# EAGLE design Euclid_Upper (EAGLE 8.2.1)
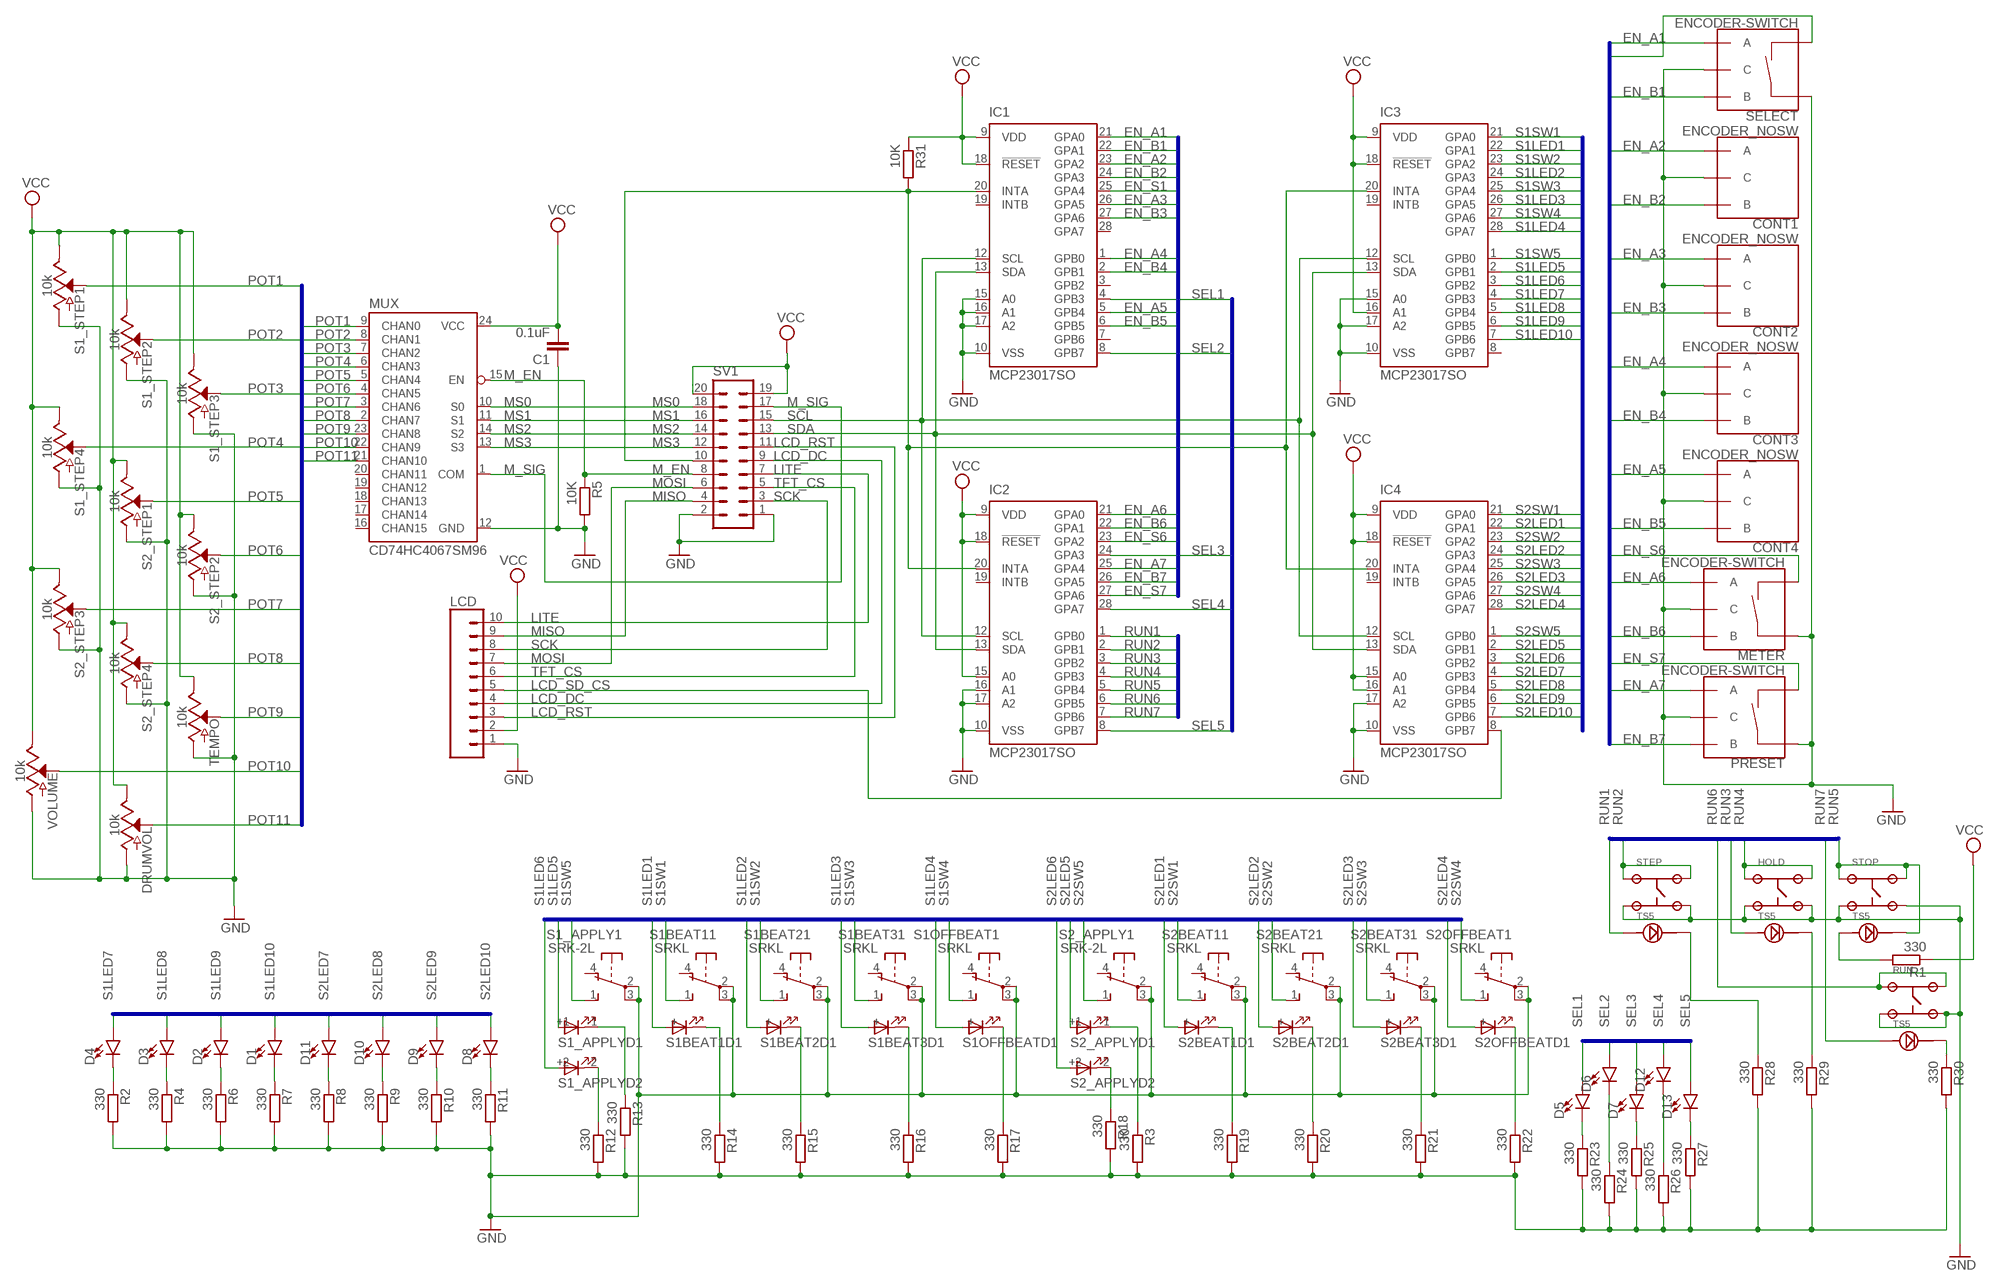
[diagram p0: schematic, sheet 1]

## Parts
C1  0.1uF  C-EUC0603  [C0603]
CONT1  ENCODER_NOSW  [ENCODER_NOSW]
CONT2  ENCODER_NOSW  [ENCODER_NOSW]
CONT3  ENCODER_NOSW  [ENCODER_NOSW]
CONT4  ENCODER_NOSW  [ENCODER_NOSW]
D1  LED3MM  [LED_3MM]
D2  LED3MM  [LED_3MM]
D3  LED3MM  [LED_3MM]
D4  LED3MM  [LED_3MM]
D5  LED3MM  [LED_3MM]
D6  LED3MM  [LED_3MM]
D7  LED3MM  [LED_3MM]
D8  LED3MM  [LED_3MM]
D9  LED3MM  [LED_3MM]
D10  LED3MM  [LED_3MM]
D11  LED3MM  [LED_3MM]
D12  LED3MM  [LED_3MM]
D13  LED3MM  [LED_3MM]
DRUMVOL  10k  POTENTIOMETER-PTH-9MM-1/20W-20%  [POT-PTH-ALPS]
HOLD  TS5  [TS5]
IC1  MCP23017SO  [SO28W]
IC2  MCP23017SO  [SO28W]
IC3  MCP23017SO  [SO28W]
IC4  MCP23017SO  [SO28W]
LCD  CONN_10"  [1X10]
METER  ENCODER-SWITCH  [ROTARY_ENC_PLAIN]
MUX  CD74HC4067SM96  74HC4067SM96  [SSOP24]
PRESET  ENCODER-SWITCH  [ROTARY_ENC_PLAIN]
R1  330  R-EU_R0603  [R0603]
R2  330  R-EU_R0603  [R0603]
R3  330  R-EU_R0603  [R0603]
R4  330  R-EU_R0603  [R0603]
R5  10K  R-EU_R0603  [R0603]
R6  330  R-EU_R0603  [R0603]
R7  330  R-EU_R0603  [R0603]
R8  330  R-EU_R0603  [R0603]
R9  330  R-EU_R0603  [R0603]
R10  330  R-EU_R0603  [R0603]
R11  330  R-EU_R0603  [R0603]
R12  330  R-EU_R0603  [R0603]
R13  330  R-EU_R0603  [R0603]
R14  330  R-EU_R0603  [R0603]
R15  330  R-EU_R0603  [R0603]
R16  330  R-EU_R0603  [R0603]
R17  330  R-EU_R0603  [R0603]
R18  330  R-EU_R0603  [R0603]
R19  330  R-EU_R0603  [R0603]
R20  330  R-EU_R0603  [R0603]
R21  330  R-EU_R0603  [R0603]
R22  330  R-EU_R0603  [R0603]
R23  330  R-EU_R0603  [R0603]
R24  330  R-EU_R0603  [R0603]
R25  330  R-EU_R0603  [R0603]
R26  330  R-EU_R0603  [R0603]
R27  330  R-EU_R0603  [R0603]
R28  330  R-EU_R0603  [R0603]
R29  330  R-EU_R0603  [R0603]
R30  330  R-EU_R0603  [R0603]
R31  10K  R-EU_R0603  [R0603]
RUN  TS5  [TS5]
S1_APPLY  SRK-2L  [SRK2L]
S1_STEP1  10k  POTENTIOMETER-PTH-9MM-1/20W-20%  [POT-PTH-ALPS]
S1_STEP2  10k  POTENTIOMETER-PTH-9MM-1/20W-20%  [POT-PTH-ALPS]
S1_STEP3  10k  POTENTIOMETER-PTH-9MM-1/20W-20%  [POT-PTH-ALPS]
S1_STEP4  10k  POTENTIOMETER-PTH-9MM-1/20W-20%  [POT-PTH-ALPS]
S1BEAT1  SRKL  [SRKL]
S1BEAT2  SRKL  [SRKL]
S1BEAT3  SRKL  [SRKL]
S1OFFBEAT  SRKL  [SRKL]
S2_APPLY  SRK-2L  [SRK2L]
S2_STEP1  10k  POTENTIOMETER-PTH-9MM-1/20W-20%  [POT-PTH-ALPS]
S2_STEP2  10k  POTENTIOMETER-PTH-9MM-1/20W-20%  [POT-PTH-ALPS]
S2_STEP3  10k  POTENTIOMETER-PTH-9MM-1/20W-20%  [POT-PTH-ALPS]
S2_STEP4  10k  POTENTIOMETER-PTH-9MM-1/20W-20%  [POT-PTH-ALPS]
S2BEAT1  SRKL  [SRKL]
S2BEAT2  SRKL  [SRKL]
S2BEAT3  SRKL  [SRKL]
S2OFFBEAT  SRKL  [SRKL]
SELECT  ENCODER-SWITCH  [ROTARY_ENC_PLAIN]
STEP  TS5  [TS5]
STOP  TS5  [TS5]
SV1  MA10-2  [MA10-2]
TEMPO  10k  POTENTIOMETER-PTH-9MM-1/20W-20%  [POT-PTH-ALPS]
VOLUME  10k  POTENTIOMETER-PTH-9MM-1/20W-20%  [POT-PTH-ALPS]

## Nets
EN_A1: IC1.21(GPA0) SELECT.A
EN_A2: CONT1.A IC1.23(GPA2)
EN_A3: CONT2.A IC1.26(GPA5)
EN_A4: CONT3.A IC1.1(GPB0)
EN_A5: CONT4.A IC1.5(GPB4)
EN_A6: IC2.21(GPA0) METER.A
EN_A7: IC2.25(GPA4) PRESET.A
EN_B1: IC1.22(GPA1) SELECT.B
EN_B2: CONT1.B IC1.24(GPA3)
EN_B3: CONT2.B IC1.27(GPA6)
EN_B4: CONT3.B IC1.2(GPB1)
EN_B5: CONT4.B IC1.6(GPB5)
EN_B6: IC2.22(GPA1) METER.B
EN_B7: IC2.26(GPA5) PRESET.B
EN_S1: IC1.25(GPA4) SELECT.SW-
EN_S6: IC2.23(GPA2) METER.SW-
EN_S7: IC2.27(GPA6) PRESET.SW-
GND: C1.1 CONT1.C CONT2.C CONT3.C CONT4.C DRUMVOL.P$3(A) HOLD.3 HOLD.4 IC1.10(VSS) IC1.15(A0) IC1.16(A1) IC1.17(A2) IC2.10(VSS) IC2.16(A1) IC2.17(A2) IC3.10(VSS) IC3.15(A0) IC3.17(A2) IC4.10(VSS) IC4.17(A2) LCD.1 METER.C METER.SW+ MUX.12(GND) PRESET.C PRESET.SW+ R2.2 R3.2 R4.2 R5.2 R6.2 R7.2 R8.2 R9.2 R10.2 R11.2 R12.2 R13.2 R14.2 R15.2 R16.2 R17.2 R18.2 R19.2 R20.2 R21.2 R22.2 R23.2 R24.2 R25.2 R26.2 R27.2 R28.2 R29.2 R30.2 RUN.3 RUN.4 S1_APPLY.2(1:P) S1_APPLY.3(1:P) S1_STEP1.P$3(A) S1_STEP2.P$3(A) S1_STEP3.P$3(A) S1_STEP4.P$3(A) S1BEAT1.2(1:P) S1BEAT1.3(1:P) S1BEAT2.2(1:P) S1BEAT2.3(1:P) S1BEAT3.2(1:P) S1BEAT3.3(1:P) S1OFFBEAT.2(1:P) S1OFFBEAT.3(1:P) S2_APPLY.2(1:P) S2_APPLY.3(1:P) S2_STEP1.P$3(A) S2_STEP2.P$3(A) S2_STEP3.P$3(A) S2_STEP4.P$3(A) S2BEAT1.2(1:P) S2BEAT1.3(1:P) S2BEAT2.2(1:P) S2BEAT2.3(1:P) S2BEAT3.2(1:P) S2BEAT3.3(1:P) S2OFFBEAT.2(1:P) S2OFFBEAT.3(1:P) SELECT.C SELECT.SW+ STEP.3 STEP.4 STOP.3 STOP.4 SV1.1 SV1.2 TEMPO.P$3(A) VOLUME.P$3(A)
LCD_DC: LCD.4 SV1.9
LCD_RST: LCD.3 SV1.11
LCD_SD_CS: IC4.8(GPB7) LCD.5
LITE: LCD.10 SV1.7
M_EN: MUX.15(EN) R5.1 SV1.8
M_SIG: MUX.1(COM) SV1.17
MISO: LCD.9 SV1.4
MOSI: LCD.7 SV1.6
MS0: MUX.10(S0) SV1.18
MS1: MUX.11(S1) SV1.16
MS2: MUX.14(S2) SV1.14
MS3: MUX.13(S3) SV1.12
N$1: IC1.20(INTA) IC2.20(INTA) IC3.20(INTA) IC4.20(INTA) R31.2 SV1.10
N$3: R12.1 S1_APPLY.-2(D2:C)
N$4: D8.K(C) R11.1
N$5: R13.1 S1_APPLY.-1(D1:C)
N$6: R14.1 S1BEAT1.-(D1:C)
N$7: R15.1 S1BEAT2.-(D1:C)
N$8: R16.1 S1BEAT3.-(D1:C)
N$9: R17.1 S1OFFBEAT.-(D1:C)
N$10: D9.K(C) R10.1
N$11: D10.K(C) R9.1
N$12: D11.K(C) R8.1
N$13: R18.1 S2_APPLY.-2(D2:C)
N$14: D1.K(C) R7.1
N$15: D3.K(C) R4.1
N$16: D4.K(C) R2.1
N$17: D2.K(C) R6.1
N$18: R21.1 S2BEAT3.-(D1:C)
N$19: R20.1 S2BEAT2.-(D1:C)
N$20: D5.K(C) R23.1
N$21: R3.1 S2_APPLY.-1(D1:C)
N$22: R19.1 S2BEAT1.-(D1:C)
N$24: D6.K(C) R24.1
N$25: D7.K(C) R25.1
N$26: R22.1 S2OFFBEAT.-(D1:C)
N$27: R30.1 RUN.5
N$28: R28.1 STEP.5
N$30: D12.K(C) R26.1
N$31: R1.2 STOP.6
N$33: HOLD.5 R29.1
N$34: D13.K(C) R27.1
POT1: MUX.9(CHAN0) S1_STEP1.P$2(S)
POT2: MUX.8(CHAN1) S1_STEP2.P$2(S)
POT3: MUX.7(CHAN2) S1_STEP3.P$2(S)
POT4: MUX.6(CHAN3) S1_STEP4.P$2(S)
POT5: MUX.5(CHAN4) S2_STEP1.P$2(S)
POT6: MUX.4(CHAN5) S2_STEP2.P$2(S)
POT7: MUX.3(CHAN6) S2_STEP3.P$2(S)
POT8: MUX.2(CHAN7) S2_STEP4.P$2(S)
POT9: MUX.23(CHAN8) TEMPO.P$2(S)
POT10: MUX.22(CHAN9) VOLUME.P$2(S)
POT11: DRUMVOL.P$2(S) MUX.21(CHAN10)
RUN1: IC2.1(GPB0) STEP.6
RUN2: IC2.2(GPB1) STEP.1 STEP.2
RUN3: HOLD.6 IC2.3(GPB2)
RUN4: HOLD.1 HOLD.2 IC2.4(GPB3)
RUN5: IC2.5(GPB4) STOP.1 STOP.2 STOP.5
RUN6: IC2.6(GPB5) RUN.1 RUN.2
RUN7: IC2.7(GPB6) RUN.6
S1LED1: IC3.22(GPA1) S1BEAT1.+(D1:A)
S1LED2: IC3.24(GPA3) S1BEAT2.+(D1:A)
S1LED3: IC3.26(GPA5) S1BEAT3.+(D1:A)
S1LED4: IC3.28(GPA7) S1OFFBEAT.+(D1:A)
S1LED5: IC3.2(GPB1) S1_APPLY.+1(D1:A)
S1LED6: IC3.3(GPB2) S1_APPLY.+2(D2:A)
S1LED7: D4.A IC3.4(GPB3)
S1LED8: D3.A IC3.5(GPB4)
S1LED9: D2.A IC3.6(GPB5)
S1LED10: D1.A IC3.7(GPB6)
S1SW1: IC3.21(GPA0) S1BEAT1.1(1:S)
S1SW2: IC3.23(GPA2) S1BEAT2.1(1:S)
S1SW3: IC3.25(GPA4) S1BEAT3.1(1:S)
S1SW4: IC3.27(GPA6) S1OFFBEAT.1(1:S)
S1SW5: IC3.1(GPB0) S1_APPLY.1(1:S)
S2LED1: IC4.22(GPA1) S2BEAT1.+(D1:A)
S2LED2: IC4.24(GPA3) S2BEAT2.+(D1:A)
S2LED3: IC4.26(GPA5) S2BEAT3.+(D1:A)
S2LED4: IC4.28(GPA7) S2OFFBEAT.+(D1:A)
S2LED5: IC4.2(GPB1) S2_APPLY.+1(D1:A)
S2LED6: IC4.3(GPB2) S2_APPLY.+2(D2:A)
S2LED7: D11.A IC4.4(GPB3)
S2LED8: D10.A IC4.5(GPB4)
S2LED9: D9.A IC4.6(GPB5)
S2LED10: D8.A IC4.7(GPB6)
S2SW1: IC4.21(GPA0) S2BEAT1.1(1:S)
S2SW2: IC4.23(GPA2) S2BEAT2.1(1:S)
S2SW3: IC4.25(GPA4) S2BEAT3.1(1:S)
S2SW4: IC4.27(GPA6) S2OFFBEAT.1(1:S)
S2SW5: IC4.1(GPB0) S2_APPLY.1(1:S)
SCK: LCD.8 SV1.3
SCL: IC1.12(SCL) IC2.12(SCL) IC3.12(SCL) IC4.12(SCL) SV1.15
SDA: IC1.13(SDA) IC2.13(SDA) IC3.13(SDA) IC4.13(SDA) SV1.13
SEL1: D5.A IC1.4(GPB3)
SEL2: D6.A IC1.8(GPB7)
SEL3: D7.A IC2.24(GPA3)
SEL4: D12.A IC2.28(GPA7)
SEL5: D13.A IC2.8(GPB7)
TFT_CS: LCD.6 SV1.5
VCC: C1.2 DRUMVOL.P$1(E) IC1.9(VDD) IC1.18(!RESET) IC2.9(VDD) IC2.15(A0) IC2.18(!RESET) IC3.9(VDD) IC3.16(A1) IC3.18(!RESET) IC4.9(VDD) IC4.15(A0) IC4.16(A1) IC4.18(!RESET) LCD.2 MUX.24(VCC) R1.1 R31.1 S1_STEP1.P$1(E) S1_STEP2.P$1(E) S1_STEP3.P$1(E) S1_STEP4.P$1(E) S2_STEP1.P$1(E) S2_STEP2.P$1(E) S2_STEP3.P$1(E) S2_STEP4.P$1(E) SV1.19 SV1.20 TEMPO.P$1(E) VOLUME.P$1(E)
Unconnected: IC1.3(GPB2) IC1.7(GPB6) IC1.19(INTB) IC1.28(GPA7) IC2.19(INTB) IC3.8(GPB7) IC3.19(INTB) IC4.19(INTB) MUX.16(CHAN15) MUX.17(CHAN14) MUX.18(CHAN13) MUX.19(CHAN12) MUX.20(CHAN11) S1_APPLY.4(1:O) S1BEAT1.4(1:O) S1BEAT2.4(1:O) S1BEAT3.4(1:O) S1OFFBEAT.4(1:O) S2_APPLY.4(1:O) S2BEAT1.4(1:O) S2BEAT2.4(1:O) S2BEAT3.4(1:O) S2OFFBEAT.4(1:O)

## Buses
POT[1..11]
EN_A[1..7],EN_B[1..7],EN_S1,EN_S[6..7]
S1SW[1..5],S1LED[1..10],S2SW[1..5],S2LED[1..10]
RUN[1..7]
SEL[1..5]

## Library data of the parts
C1 = rcl:C-EU: CAPACITOR, European symbol
CONT1-CONT4 = SparkFun-Switches:ENCODER_NOSW
D1-D13 = SparkFun-LED:LED: LED (Generic) Standard schematic elements and footprints for 5mm, 3mm, 1206, and 0603 sized LEDs. Generic LEDs with no color specified.; PROD_ID: DIO-08794
DRUMVOL S1_STEP1-S1_STEP4 S2_STEP1-S2_STEP4 TEMPO VOLUME = SparkFun-Resistors:POTENTIOMETER: Potentiometer (Pot) Three-terminal potentiometers, with an adjustable wiper and two adjustable resistors. A pot can be used to create a configurable voltage divider, or as a variable resistor. Variants ALPS_POT and ALPS_POT_KIT - PTH, breadboard compatible, 9mm square pots Rotary Potentiometer - Linear (10k ohm) <https://www.sparkfun.com/products/9288> (COM-09288) The KIT variant exposes copper on only one side of the PTH pad, so the part can only be assembled on one side of the PCB. Useful for beginner soldering kits.; PROD_ID: RES-09177; SF_SKU: COM-09288
HOLD RUN STEP STOP = switches-alt:TS5
IC1-IC4 = adafruit:MCP23017: http://ww1.microchip.com/downloads/en/DeviceDoc/21952a.pdf Source: http://ww1.microchip.com/downloads/en/DeviceDoc/21952a.pdf
LCD = SparkFun-Connectors:CONN_10: Multi connection point. Often used as Generic Header-pin footprint for 0.1 inch spaced/style header connections On any of the 0.1 inch spaced packages, you can populate with these: Break Away Headers - Straight <https://www.sparkfun.com/products/116> (PRT-00116) Break Away Male Headers - Right Angle <https://www.sparkfun.com/products/553> (PRT-00553) Female Headers <https://www.sparkfun.com/products/115> (PRT-00115) Break Away Headers - Machine Pin <https://www.sparkfun.com/products/117> (PRT-00117) Break Away Female Headers - Swiss Machine Pin <https://www.sparkfun.com/products/743> (PRT-00743) Arduino Stackable Header - 10 Pin <https://www.sparkfun.com/products/11376> (PRT-11376) For SCREWTERMINALS and SPRING TERMINALS visit here: Screw Terimnals on SparkFun.com <https://www.sparkfun.com/search/results?term=Screw+Terminals> (5mm/3.5mm/2.54mm spacing) This device is also useful as a general connection point to wire up your design to another part of your project. Our various solder wires solder well into these plated through hole pads. Hook-Up Wire - Assortment (Stranded, 22 AWG) <https://www.sparkfun.com/products/11375> (PRT-11375) Hook-Up Wire - Assortment (Solid Core, 22 AWG) <https://www.sparkfun.com/products/11367> (PRT-11367) View the entire wire category on our website here <https://www.sparkfun.com/categories/141> Special notes: Molex polarized connector foot print use with SKU : PRT-08231 with associated crimp pins and housings. 1MM SMD Version SKU: PRT-10208 NOTES ON THE VARIANTS LOCK and LOCK_LONGPADS... This footprint was designed to help hold the alignment of a through-hole component (i.e. 6-pin header) while soldering it into place. You may notice that each hole has been shifted either up or down by 0.005 of an inch from it's more standard position (which is a perfectly straight line). This slight alteration caused the pins (the squares in the middle) to touch the edges of the holes. Because they are alternating, it causes a "brace" to hold the component in place. 0.005 has proven to be the perfect amount of "off-center" position when using our standard breakaway headers. Although looks a little odd when you look at the bare footprint, once you have a header in there, the alteration is very hard to notice. Also,if you push a header all the way into place, it is covered up entirely on the bottom side.; PROD_ID: CONN-11563
METER PRESET SELECT = SparkFun-Switches:ENCODER-SWITCH: Rotary Encoder w/ Select Switch Encoders rotate similarly to potentiometers, but they’re different from potentiometers in that an encoder has full rotation without limits. They output gray code so that you can tell how much and in which direction the encoder has been turned. This encoder includes a push-down select switch built into the shaft. SparkFun Products Rotary Encoder <https://www.sparkfun.com/products/9117> (COM-09117); SF_SKU: COM-09117
MUX = SparkFun-IC-Logic:74*4067: 16-channel analog MUX Datasheet <http://www.sparkfun.com/datasheets/IC/cd74hc4067.pdf> SparkFun Products MP3 Trigger <https://www.sparkfun.com/products/13720> (WIG-13720) SparkFun Analog/Digital MUX Breakout - CD74HC4067 <https://www.sparkfun.com/products/9056> (BOB-09056); PROD_ID: IC-08252
R1-R31 = rcl:R-EU_: RESISTOR, European symbol
S1_APPLY S2_APPLY = switch-misc:SRK-: SWITCH
S1BEAT1-S1BEAT3 S1OFFBEAT S2BEAT1-S2BEAT3 S2OFFBEAT = switch-misc:SRKL: SWITCH
SV1 = con-lstb:MA10-2: PIN HEADER; OC_FARNELL: unknown; OC_NEWARK: unknown

## Board
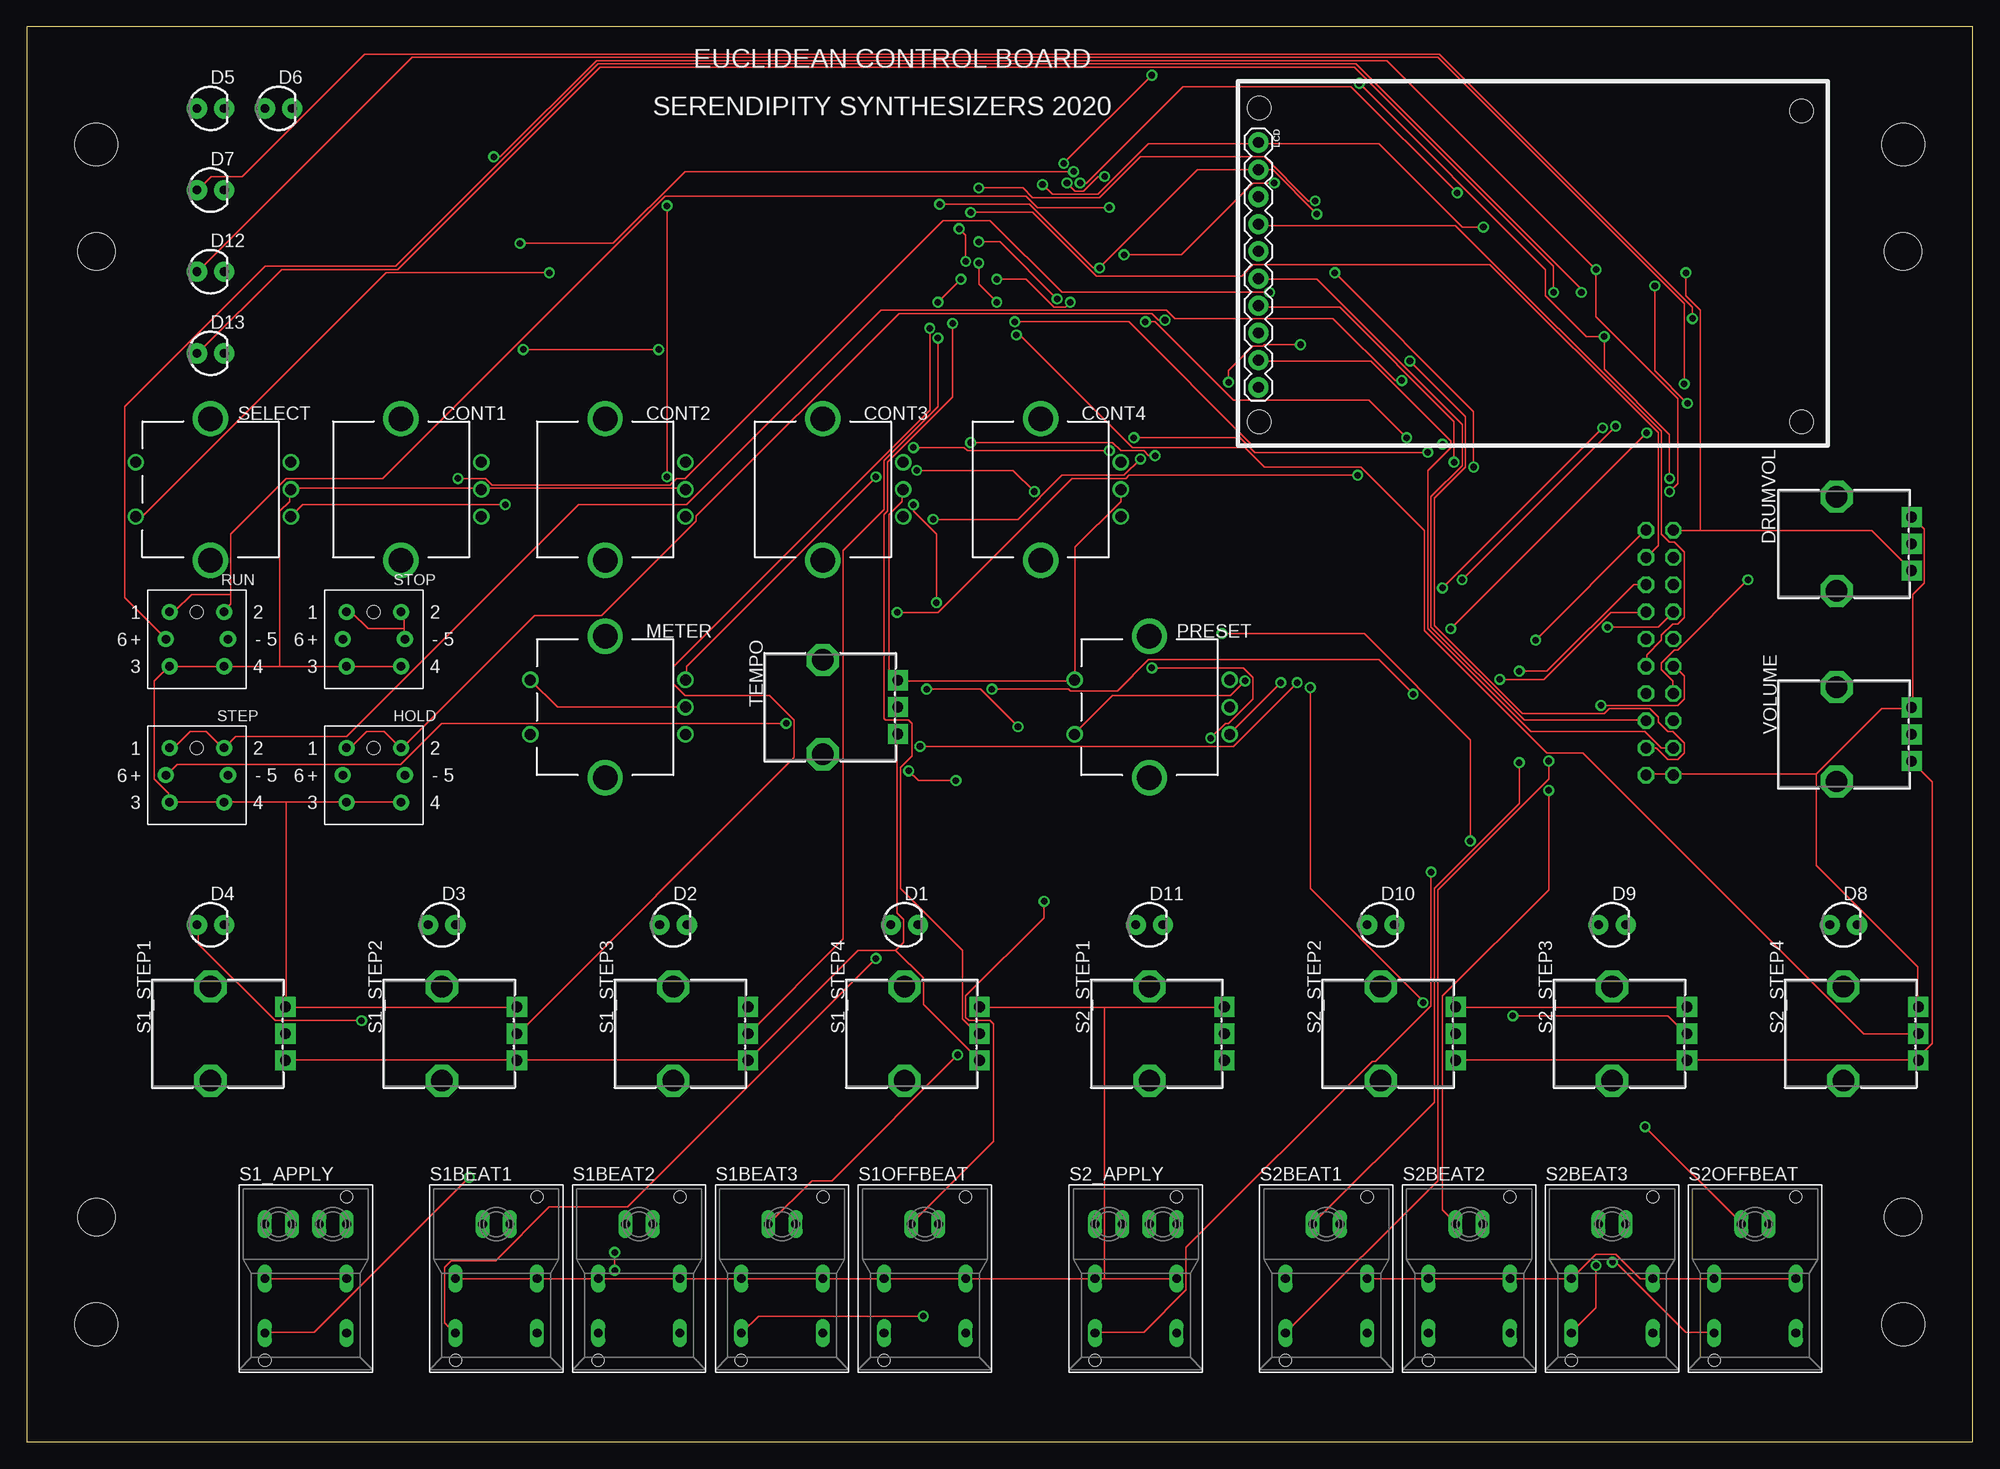
[diagram p1: board, top side]
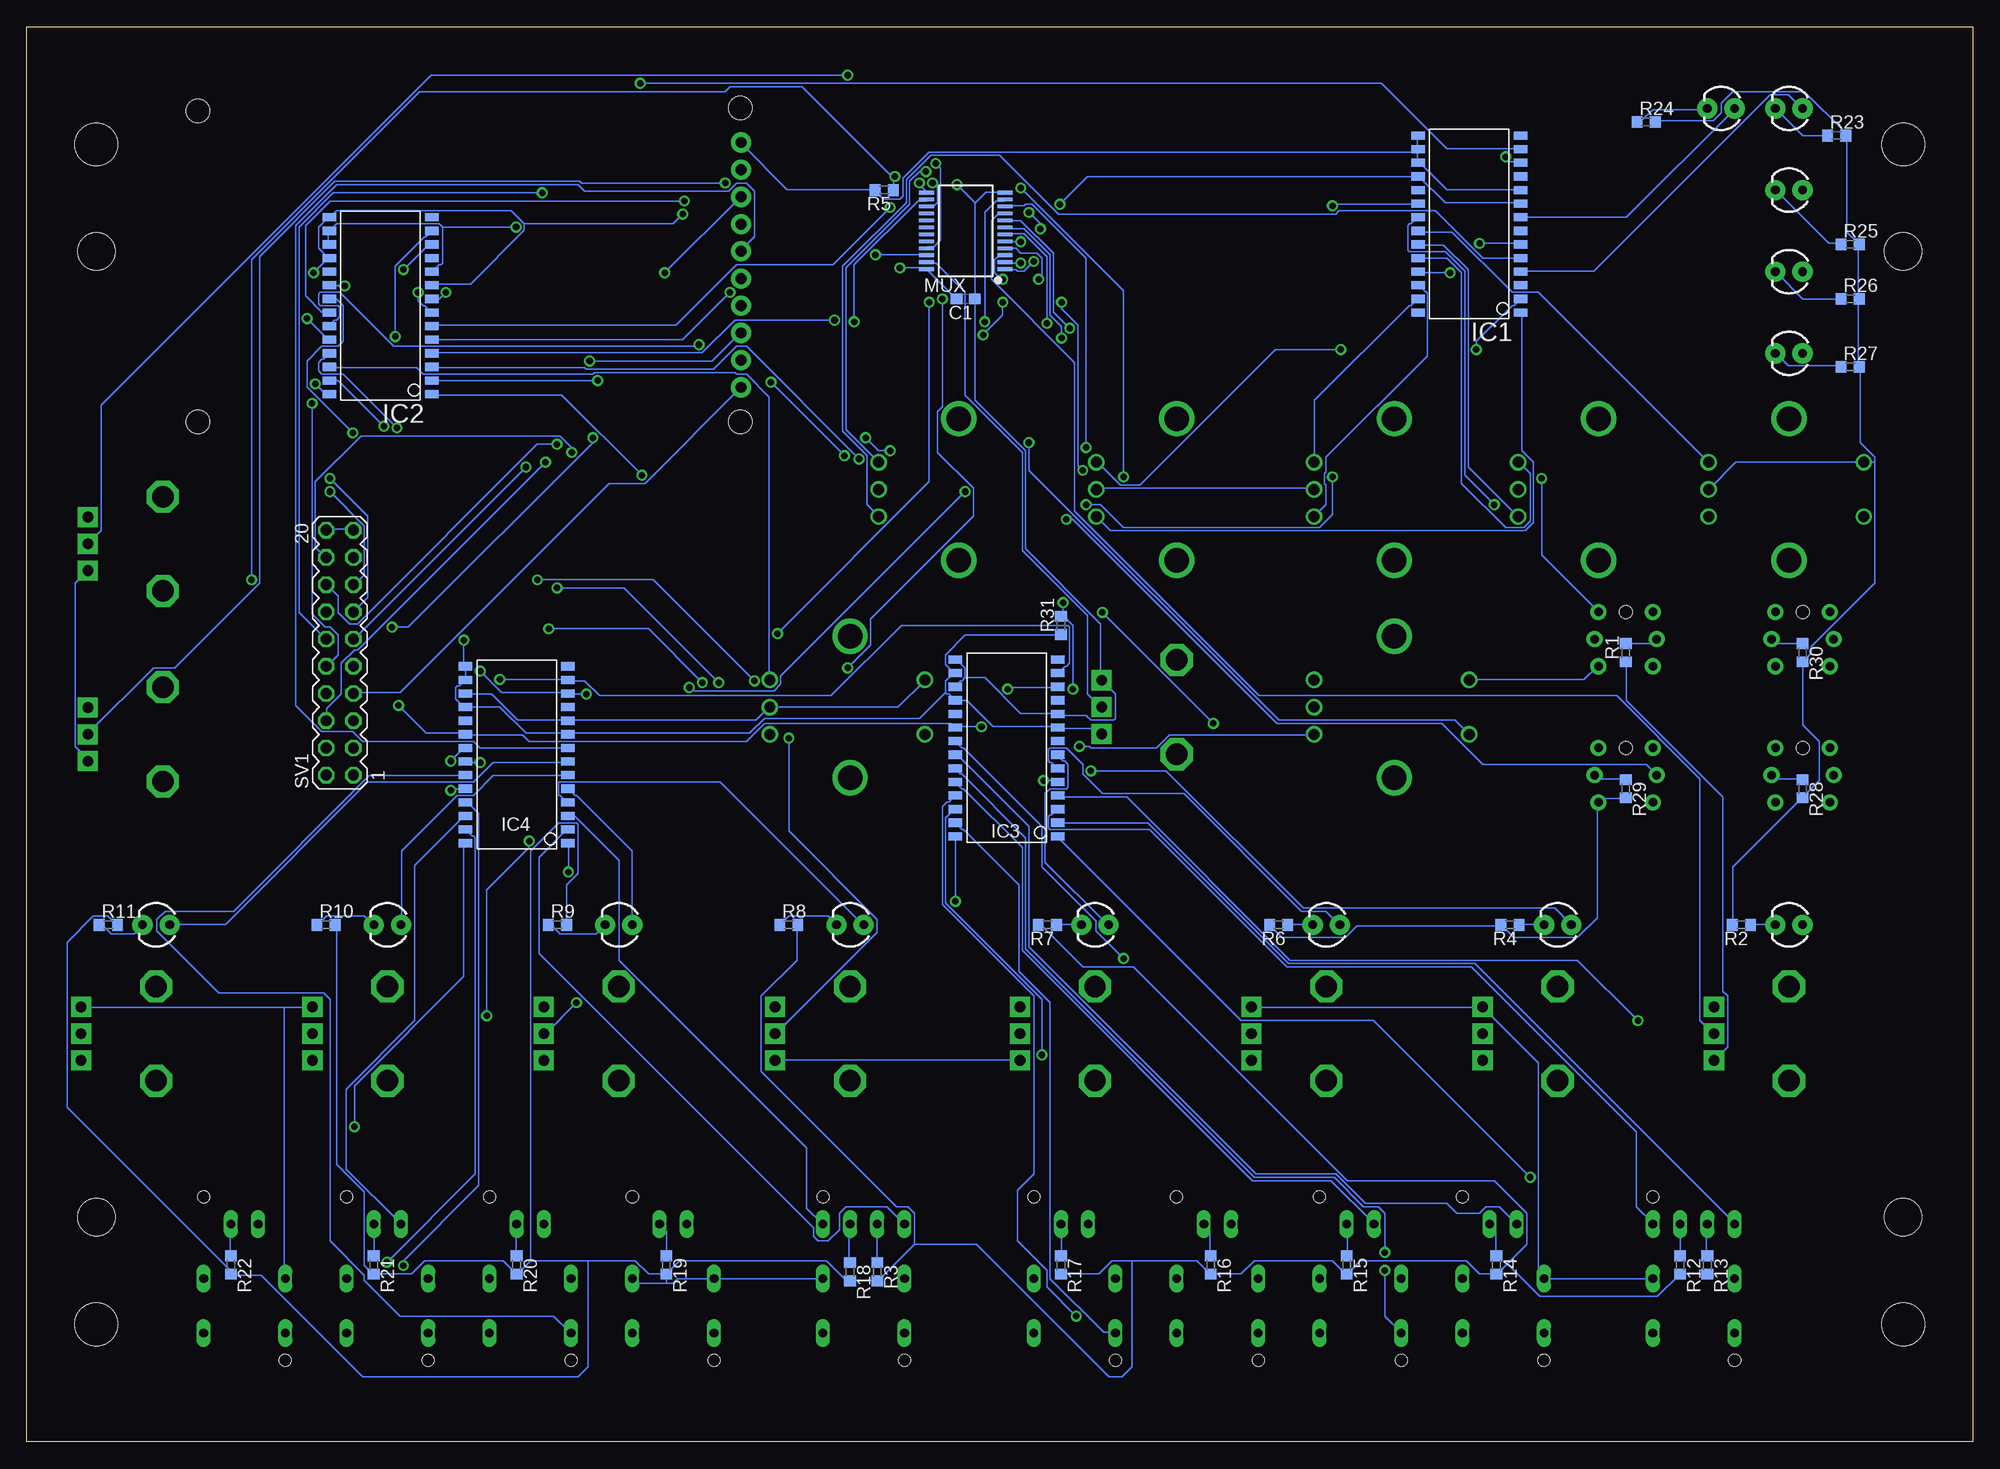
[diagram p2: board, bottom side, seen from below]

Size 181.61 x 132.08 mm. Coordinates in mm from the lower left corner, seen from the top.
Outline: 0,0 181.61,0 181.61,132.08 0,132.08 0,0
Copper layers (1*16): Top 0.035mm / dielectric 1.5mm / Bottom 0.035mm
Design rules "default": minimum track width 6mil, minimum drill 24mil, track to track 6mil, track to pad 6mil, pad to pad 6mil, via to via 6mil, smd to smd 6mil, copper to edge 32mil, drill to drill 6mil, minimum pad ring 10mil, minimum via ring 8mil, stop-mask expansion 4mil, vias tented up to drill 0mil, thermal gap 10mil
Holes 4 mm at 6.5,10.97 6.5,121.1 175.11,121.1 175.11,10.97
Holes 3.5 mm at 6.5,20.97 175.11,20.97 175.11,111.1 6.5,111.1
Holes 2.2 mm at 115.03,124.5 165.64,124.21 165.64,95.21 115.03,95.21
tRestrict: area 28.8,21.8 to 30.9,23.9; area 21.2,6.6 to 23.2,8.6; area 46.6,21.8 to 48.6,23.9; area 39,6.6 to 41,8.6; area 59.9,21.8 to 62,23.9; area 52.3,6.6 to 54.4,8.6; area 73.3,21.8 to 75.3,23.9; area 65.7,6.6 to 67.7,8.6; area 86.6,21.8 to 88.6,23.9; area 79,6.6 to 81,8.6; area 106.3,21.8 to 108.3,23.9; area 98.7,6.6 to 100.7,8.6; 12 more areas
bRestrict: area 28.8,21.8 to 30.9,23.9; area 21.2,6.6 to 23.2,8.6; area 46.6,21.8 to 48.6,23.9; area 39,6.6 to 41,8.6; area 59.9,21.8 to 62,23.9; area 52.3,6.6 to 54.4,8.6; area 73.3,21.8 to 75.3,23.9; area 65.7,6.6 to 67.7,8.6; area 86.6,21.8 to 88.6,23.9; area 79,6.6 to 81,8.6; area 106.3,21.8 to 108.3,23.9; area 98.7,6.6 to 100.7,8.6; 12 more areas
vRestrict: area 91.4,109.2 to 96.5,116.8

### Footprints (pad centres in the part's own frame; a part is rotated, then mirrored left to right if it is on the bottom)
C0603 = smd 1.1 x 1: 1 -0.85,0; 2 0.85,0
ENCODER_NOSW = drill 1.016: A 7.493,-2.54; B 7.493,2.54; C 7.493,0 | drill 2.286: P$3 0,6.604; P$4 0,-6.604
LED_3MM = drill 0.813 pad 1.88: A -1.27,0; K 1.27,0
POT-PTH-ALPS = drill 1 pad 1.88 square: P$1 7,-2.5; P$2 7,0; P$3 7,2.5 | drill 2 octagon: P$4 0,-4.4; P$5 0,4.4
TS5 = drill 0.8 pad 1.5: 1 -2.54,2.54; 2 2.54,2.54; 3 -2.54,-2.54; 4 2.54,-2.54; 5 2.9,0; 6 -2.9,0 | hole 1.2: 0,2.54
SO28W = smd 0.762 x 1.27: 1 -7.62,-4.78; 2 -6.35,-4.78; 3 -5.08,-4.78; 4 -3.81,-4.78; 5 -2.54,-4.78; 6 -1.27,-4.78; 7 0,-4.78; 8 1.27,-4.78; 9 2.54,-4.78; 10 3.81,-4.78; 11 5.08,-4.78; 12 6.35,-4.78; 13 7.62,-4.78; 14 8.89,-4.78; 15 8.89,4.78; 16 7.62,4.78; 17 6.35,4.78; 18 5.08,4.78; 19 3.81,4.78; 20 2.54,4.78; 21 1.27,4.78; 22 0,4.78; 23 -1.27,4.78; 24 -2.54,4.78; 25 -3.81,4.78; 26 -5.08,4.78; 27 -6.35,4.78; 28 -7.62,4.78
1X10 = drill 1.016 pad 1.88: 1 0,0; 2 2.54,0; 3 5.08,0; 4 7.62,0; 5 10.16,0; 6 12.7,0; 7 15.24,0; 8 17.78,0; 9 20.32,0; 10 22.86,0
ROTARY_ENC_PLAIN = drill 1.016: A 7.493,-2.54; B 7.493,2.54; C 7.493,0; SW+ -6.985,2.54; SW- -6.985,-2.54 | drill 2.286: P$3 0,6.604; P$4 0,-6.604
SSOP24 = smd 0.348 x 1.397: 1 -3.575,-3.656; 2 -2.925,-3.656; 3 -2.275,-3.656; 4 -1.625,-3.656; 5 -0.975,-3.656; 6 -0.325,-3.656; 7 0.325,-3.656; 8 0.975,-3.656; 9 1.625,-3.656; 10 2.275,-3.656; 11 2.925,-3.656; 12 3.575,-3.656; 13 3.575,3.656; 14 2.925,3.656; 15 2.275,3.656; 16 1.625,3.656; 17 0.975,3.656; 18 0.325,3.656; 19 -0.325,3.656; 20 -0.975,3.656; 21 -1.625,3.656; 22 -2.275,3.656; 23 -2.925,3.656; 24 -3.575,3.656
R0603 = smd 1 x 1.1: 1 -0.85,0; 2 0.85,0
SRK2L = drill 0.813 long: 1 -3.81,-5.08; 2 -3.81,0; 3 3.81,0; 4 3.81,-5.08; +1 -3.81,5.08; +2 3.81,5.08; -1 -1.27,5.08; -2 1.27,5.08 | hole 1.118: 3.81,7.62; -3.81,-7.62
SRKL = drill 0.813 long: 1 -3.81,-5.08; 2 -3.81,0; 3 3.81,0; 4 3.81,-5.08; + -1.27,5.08; - 1.27,5.08 | hole 1.118: 3.81,7.62; -3.81,-7.62
MA10-2 = drill 1.016 octagon: 1 -11.43,-1.27; 2 -11.43,1.27; 3 -8.89,-1.27; 4 -8.89,1.27; 5 -6.35,-1.27; 6 -6.35,1.27; 7 -3.81,-1.27; 8 -3.81,1.27; 9 -1.27,-1.27; 10 -1.27,1.27; 11 1.27,-1.27; 12 1.27,1.27; 13 3.81,-1.27; 14 3.81,1.27; 15 6.35,-1.27; 16 6.35,1.27; 17 8.89,-1.27; 18 8.89,1.27; 19 11.43,-1.27; 20 11.43,1.27

### Placement (x,y rotation side)
C1  93.98,106.68 180 bottom
CONT1  34.92,88.9 0 top
CONT2  53.98,88.9 0 top
CONT3  74.3,88.9 0 top
CONT4  94.61,88.9 0 top
D1  81.92,48.26 0 top
D2  60.33,48.26 0 top
D3  38.73,48.26 0 top
D4  17.14,48.26 0 top
D5  17.14,124.46 0 top
D6  23.5,124.46 0 top
D7  17.14,116.84 0 top
D8  169.54,48.26 0 top
D9  147.96,48.26 0 top
D10  126.36,48.26 0 top
D11  104.78,48.26 0 top
D12  17.14,109.22 0 top
D13  17.14,101.6 0 top
DRUMVOL  168.91,83.82 0 top
HOLD  32.38,62.23 0 top
IC1  46.99,113.03 90 bottom
IC2  148.59,105.41 90 bottom
IC3  90.17,64.14 90 bottom
IC4  135.89,63.5 90 bottom
LCD  114.94,121.28 270 top
METER  53.98,68.58 0 top
MUX  93.98,113.03 90 bottom
PRESET  104.78,68.58 0 top
R1  32.38,73.66 90 bottom
R2  21.59,48.26 180 bottom
R3  102.23,15.88 270 bottom
R4  43.18,48.26 180 bottom
R5  101.6,116.84 180 bottom
R6  64.77,48.26 180 bottom
R7  86.36,48.26 180 bottom
R8  110.49,48.26 0 bottom
R9  132.08,48.26 0 bottom
R10  153.67,48.26 0 bottom
R11  173.99,48.26 0 bottom
R12  27.3,16.51 270 bottom
R13  24.77,16.51 270 bottom
R14  44.45,16.51 270 bottom
R15  58.42,16.51 270 bottom
R16  71.12,16.51 270 bottom
R17  85.09,16.51 270 bottom
R18  104.78,15.88 270 bottom
R19  121.92,16.51 270 bottom
R20  135.89,16.51 270 bottom
R21  149.22,16.51 270 bottom
R22  162.56,16.51 270 bottom
R23  12.7,121.92 0 bottom
R24  30.48,123.19 0 bottom
R25  11.43,111.76 0 bottom
R26  11.43,106.68 0 bottom
R27  11.43,100.33 0 bottom
R28  15.88,60.96 270 bottom
R29  32.38,60.96 270 bottom
R30  15.88,73.66 270 bottom
R31  85.09,76.2 90 bottom
RUN  15.88,74.93 0 top
S1_APPLY  26.04,15.24 0 top
S1_STEP1  17.14,38.1 0 top
S1_STEP2  38.73,38.1 0 top
S1_STEP3  60.33,38.1 0 top
S1_STEP4  81.92,38.1 0 top
S1BEAT1  43.81,15.24 0 top
S1BEAT2  57.15,15.24 0 top
S1BEAT3  70.48,15.24 0 top
S1OFFBEAT  83.82,15.24 0 top
S2_APPLY  103.5,15.24 0 top
S2_STEP1  104.78,38.1 0 top
S2_STEP2  126.36,38.1 0 top
S2_STEP3  147.96,38.1 0 top
S2_STEP4  169.54,38.1 0 top
S2BEAT1  121.28,15.24 0 top
S2BEAT2  134.62,15.24 0 top
S2BEAT3  147.96,15.24 0 top
S2OFFBEAT  161.29,15.24 0 top
SELECT  17.14,88.9 0 top
STEP  15.88,62.23 0 top
STOP  32.38,74.93 0 top
SV1  152.4,73.66 90 bottom
TEMPO  74.3,68.58 0 top
VOLUME  168.91,66.04 0 top

### Tracks (layer width: path | path; a pad name or v marks a point on that pad's centre or on a via)
EN_A1  (via drill 0.61)
  Top 0.152: v44.65,87.48 25.76,87.48 SELECT.A
  Bottom 0.152: v44.65,87.48 47.4,90.22 47.4,109.27 49.23,111.1 52.58,111.1 52.73,111.25 52.73,113.54 52.58,113.69 52.43,113.69 51.82,114.3 IC1.21
EN_A2
  Bottom 0.152: IC1.23 51.66,111.71 49.38,111.71 47.09,109.42 47.09,90.98 42.52,86.41 CONT1.A
EN_A3
  Bottom 0.152: CONT2.A 60.35,87.48 60.35,89.31 60.5,89.46 60.5,90.37 60.35,90.53 60.35,91.9 50.9,101.35 50.9,107.29 51.05,107.29 51.66,107.9 IC1.26
EN_A4
  Bottom 0.152: CONT3.A 80.47,85.04 41.76,85.04 41,85.8 41,91.44 42.06,92.51 42.06,105.31 IC1.1
EN_A5
  Bottom 0.152: IC1.5 45.72,110.49 50.14,114.91 59.13,114.91 59.44,114.61 85.34,114.61 90.83,120.09 97.23,120.09 99.52,117.81 99.52,115.67 105.46,109.73 105.46,94.34 103.17,92.05 103.17,87.48 102.11,86.41 CONT4.A
EN_A6  (via drill 0.61)
  Top 0.152: v132.89,75.89 v151.18,94.18 | v118.57,70.87 112.62,64.92 v83.36,64.92
  Bottom 0.152: IC2.21 152.71,106.68 152.09,106.07 152.09,102.72 152.55,102.26 154.08,102.26 155.45,100.89 155.45,98.45 v151.18,94.18 | v132.89,75.89 123.6,75.89 v118.57,70.87 | v83.36,64.92 82.45,64.92 82.3,64.77 76.2,64.77 74.98,65.99 61.57,65.99 METER.A
EN_A7  (via drill 0.61)
  Top 0.152: v132.13,79.7 v147.07,94.64 | v117.04,70.87 112.32,66.14 PRESET.A
  Bottom 0.152: v147.07,94.64 152.09,99.67 154.08,99.67 154.38,99.97 154.38,100.74 154.08,101.04 153.92,101.04 153.47,101.5 IC2.25 | v132.13,79.7 125.88,79.7 v117.04,70.87
EN_B1
  Bottom 0.152: IC1.22 51.66,112.93 48.62,112.93 42.98,107.29 40.54,107.29 24.69,91.44 SELECT.B
EN_B2
  Bottom 0.152: IC1.24 49.07,110.49 47.7,109.12 47.7,89.46 43.59,85.34 41.91,85.34 41.3,85.95 41.3,90.37 42.37,91.44 CONT1.B
EN_B3
  Bottom 0.152: IC1.27 51.82,106.68 52.43,106.07 52.58,106.07 61.42,97.23 61.42,91.44 CONT2.B
EN_B4  (via drill 0.61)
  Top 0.152: v58.98,101.96 v46.33,101.96
  Bottom 0.152: v46.33,101.96 46.33,102.72 42.98,106.07 42.82,106.07 IC1.2 | v58.98,101.96 65.08,101.96 77.72,89.31 79.55,89.31 81.69,91.44 CONT3.B
EN_B5  (via drill 0.61)
  Top 0.152: v46.02,111.86 54.71,111.86 61.42,118.57 v97.69,118.57
  Bottom 0.152: v46.02,111.86 42.22,111.86 IC1.6 | v97.69,118.57 98.3,118.57 99.21,117.65 99.21,115.52 105.16,109.58 105.16,94.49 CONT4.B
EN_B6  (via drill 0.61)
  Top 0.152: v120.24,115.82 119.63,115.82 115.52,119.94 103.94,119.94 100.13,116.13 93.88,116.13 92.96,117.04 v88.85,117.04 | v79.25,90.07 61.57,72.39 61.57,71.17 METER.B
  Bottom 0.152: v120.24,115.82 153.31,115.82 155.6,113.54 155.6,106.98 154.08,105.46 153.47,105.46 IC2.22 | v88.85,117.04 79.25,107.44 v79.25,90.07
EN_B7
  Bottom 0.152: IC2.26 153.31,100.28 145.24,100.28 144.63,99.67 128.78,99.67 128.63,99.82 115.52,99.82 115.37,99.67 114.45,99.67 112.32,97.54 112.32,71.17 PRESET.B
EN_S1  (via drill 0.61)
  Top 0.152: v48.77,109.12 33.53,109.12 10.82,86.41 10.21,86.41 SELECT.SW-
  Bottom 0.152: v48.77,109.12 51.66,109.12 IC1.25
EN_S6  (via drill 0.61)
  Top 0.152: v118.87,102.41 115.52,102.41 115.37,102.26 114.45,102.26 112.17,99.97 v112.17,98.91 | v105.31,92.05 104.7,92.05 104.24,92.51 102.11,92.51 101.35,93.27 v88.09,93.27
  Bottom 0.152: v118.87,102.41 119.02,102.26 147.37,102.26 152.4,107.29 154.23,107.29 154.38,107.14 154.38,106.22 154.23,106.07 152.55,106.07 152.4,105.92 152.4,105 152.71,104.7 152.86,104.7 153.31,104.24 IC2.23 | v105.31,92.05 v112.17,98.91 | v88.09,93.27 88.09,90.68 64.77,67.36 48.31,67.36 METER.SW-
EN_S7  (via drill 0.61)
  Top 0.152: v133.96,80.47 v148.28,94.79 | v113.69,71.02 112.32,69.65 101.35,69.65 97.84,66.14 PRESET.SW-
  Bottom 0.152: IC2.27 152.55,99.06 v148.28,94.79 | v133.96,80.47 123.14,80.47 v113.69,71.02
GND  (via drill 0.61)
  Top 0.152: v135.94,113.39 133.96,113.39 126.19,121.16 115.06,121.16 LCD.1 114.91,121.16 104.7,121.16 99.97,116.43 95.71,116.43 v94.79,117.35 | CONT3.C 81.69,88.85 81.69,87.78 80.47,86.56 80.47,71.93 81.23,71.17 TEMPO.P$3 81.38,71.02 97.69,71.02 PRESET.SW+ 97.84,71.17 97.84,83.52 102.11,87.78 CONT4.C | CONT2.C 61.42,89 42.52,89 CONT1.C 42.37,89 24.69,89 SELECT.C 24.54,88.85 24.54,87.78 23.62,86.87 23.62,72.39 | S1_STEP2.P$3 45.72,40.54 24.23,40.54 S1_STEP1.P$3 24.23,40.69 24.23,59.74 | HOLD.4 34.9,59.74 29.87,59.74 HOLD.3 29.72,59.74 24.23,59.74 | 24.23,59.74 18.44,59.74 STEP.4 18.29,59.74 13.41,59.74 STEP.3 13.26,59.74 13.26,60.5 11.89,61.87 11.89,71.02 13.26,72.39 RUN.3 RUN.4 23.62,72.39 | STOP.4 STOP.3 23.62,72.39 | METER.C 49.53,68.58 METER.SW+ | S1_APPLY.3 S1_APPLY.2 | S1BEAT1.2 S1BEAT1.3 S1BEAT2.2 S1BEAT2.3 S1BEAT3.2 S1BEAT3.3 S1OFFBEAT.2 S1OFFBEAT.3 S2_APPLY.2 100.58,15.24 | SV1.1 151.18,62.33 153.62,62.33 SV1.2 153.77,62.33 167.03,62.33 | DRUMVOL.P$3 176.02,86.26 177.09,85.19 177.09,80.16 176.02,79.1 176.02,68.58 VOLUME.P$3 175.87,68.43 173.13,68.43 167.03,62.33 | S2_STEP2.P$3 133.5,40.54 154.84,40.54 S2_STEP3.P$3 | 100.58,40.54 111.71,40.54 S2_STEP1.P$3 | 100.58,40.54 89,40.54 S1_STEP4.P$3 | S2OFFBEAT.3 S2OFFBEAT.2 S2BEAT3.3 150.57,15.24 148.28,17.53 146.46,17.53 144.17,15.24 S2BEAT3.2 S2BEAT2.3 S2BEAT2.2 S2BEAT1.3 | S2_APPLY.3 100.58,15.24 | 100.58,15.24 100.58,40.54 | 167.03,62.33 167.03,53.8 176.48,44.35 176.48,40.69 S2_STEP4.P$3
  Bottom 0.152: IC1.10 42.22,116.89 49.07,116.89 51.66,119.48 IC1.17 51.82,119.48 51.82,120.4 | 51.82,120.4 51.82,120.55 IC1.16 | IC1.15 51.82,121.92 51.82,120.7 IC1.16 | 142.8,113.39 142.8,110.03 142.95,109.88 143.1,109.88 143.71,109.27 IC2.10 | 142.8,113.39 143.1,113.69 152.71,113.69 153.31,113.08 IC2.16 153.47,112.93 153.47,111.86 IC2.17 | LCD.1 114.91,121.16 110.64,116.89 102.56,116.89 R5.2 102.41,116.74 101.65,115.98 100.13,115.98 99.82,116.28 99.82,117.96 97.38,120.4 51.82,120.4 | v135.94,113.39 142.8,113.39 | 51.82,120.4 IC1.16 | 94.03,71.32 94.34,71.02 94.49,71.02 94.94,70.56 IC3.17 | 94.03,71.32 94.03,72.24 94.94,73.15 IC3.15 | 94.03,71.32 92.2,71.32 88.85,67.97 85.5,67.97 IC3.10 85.34,67.82 82.75,67.82 82.3,67.36 80.16,67.36 80.01,67.51 80.01,69.8 81.23,71.02 TEMPO.P$3 81.38,71.17 81.38,76.35 88.39,83.36 88.39,92.51 93.12,97.23 93.12,106.68 C1.1 | IC4.17 140.66,69.8 138.23,69.8 135.79,67.36 131.22,67.36 IC4.10 131.06,67.36 113.54,67.36 112.32,68.58 PRESET.C 100.28,68.58 97.84,71.02 PRESET.SW+ | SELECT.C 22.1,91.44 SELECT.SW+ 9.14,91.44 | S1_STEP3.P$3 67.21,40.54 45.87,40.54 S1_STEP2.P$3 45.72,40.54 40.54,35.36 40.54,15.7 40.08,15.24 S1BEAT1.2 S1_APPLY.3 | METER.SW+ 46.94,71.17 36.27,71.17 35.05,72.39 STOP.4 | CONT3.C 81.69,89 61.57,89 CONT2.C | v94.79,117.35 93.12,115.67 93.13,115.61 | 157.58,40.54 154.99,40.54 S2_STEP3.P$3 | 157.58,40.54 176.48,40.54 S2_STEP4.P$3 | 121.92,14.78 124.51,14.78 124.97,15.24 S2BEAT1.3 | 121.92,14.78 121.31,14.78 120.85,15.24 S2BEAT1.2 S2_APPLY.3 | 157.58,40.54 157.58,15.24 S2OFFBEAT.2 | R11.2 173.28,48.31 174.04,49.07 175.41,49.07 177.85,46.63 177.85,31.24 162.61,16 162.61,15.7 R22.2 162.46,15.54 159.72,15.54 150.27,6.1 130.15,6.1 129.24,7.01 129.24,16.92
  Bottom 0.152: 98.75,18.44 98.75,21.34 99.36,21.95 100.43,21.95 113.08,34.59 113.08,41.6 109.73,44.96 109.73,48.16 R8.2 | 98.75,18.44 102.11,15.09 R3.2 102.26,15.09 104.7,15.09 R18.2 104.85,15.09 105.16,15.09 106.98,16.92 120.7,16.92 121.92,15.7 | 121.92,15.7 123.6,15.7 124.82,16.92 129.24,16.92 | 134.57,16.92 129.24,16.92 | 134.57,16.92 135.79,15.7 R20.2 135.94,15.7 137.16,16.92 144.47,16.92 145.69,15.7 149.2,15.7 R21.2 149.35,15.7 150.11,16.46 150.11,23.32 152.71,25.91 152.71,48.16 R10.2 | 134.57,16.92 134.57,55.17 131.98,57.76 130.3,57.76 130.15,57.61 130.15,53.03 131.22,51.97 131.22,48.31 R9.2 | 121.92,15.7 R19.2 121.92,14.78 | R6.2 65.53,48.16 64.47,47.09 58.52,47.09 57.45,48.16 44.04,48.16 R4.2 43.89,48.16 42.82,47.09 36.88,47.09 35.05,48.92 35.05,59.59 HOLD.4 34.9,59.74 34.59,60.05 32.46,60.05 R29.2 | 10.67,106.68 10.67,100.43 R27.2 10.52,100.28 10.52,93.27 9.14,91.9 9.14,91.44 | 10.67,106.68 10.67,111.71 R25.2 10.67,111.86 11.73,112.93 11.73,121.92 R23.2 11.89,121.92 11.89,122.22 15.7,126.03 22.4,126.03 23.47,124.97 23.47,124.05 24.23,123.29 29.57,123.29 R24.2 | 10.67,106.68 R26.2 | R2.2 22.4,48.31 22.4,53.65 16,60.05 R28.2 15.85,60.2 14.33,61.72 14.33,65.38 15.85,66.9 15.85,72.69 R30.2 15.85,72.85 15.09,73.61 15.09,74.22 9.14,80.16 9.14,91.44 | R13.2 24.84,15.7 27.28,15.7 R12.2 27.43,15.54 29.41,13.56 40.39,13.56 43.43,16.61 | 78.49,16.92 72.39,16.92 71.17,15.7 R16.2 71.02,15.7 68.28,15.7 67.06,16.92 59.74,16.92 58.52,15.7 R15.2 58.37,15.7 57.15,16.92 47.24,16.92 46.02,15.7 44.5,15.7 R14.2 44.35,15.7 43.43,16.61 | 78.49,16.92 80.31,16.92 81.53,15.7 85.04,15.7 R17.2
  Bottom 0.152: 43.43,16.61 41.6,18.44 41.6,21.34 44.65,24.38 58.37,24.38 78.33,44.35 83.06,44.35 86.87,48.16 87.17,48.16 R7.2 | 98.75,18.44 92.96,18.44 80.62,6.1 79.4,6.1 78.49,7.01 78.49,16.92
  Bottom 0.156: C1.1 93.13,115.61 92.09,116.66 90.38,116.66 MUX.12
LCD_DC
  Top 0.152: SV1.9 151.18,72.39 151.18,73.46 152.55,74.83 152.55,75.29 153.62,76.35 154.08,76.35 154.69,76.96 154.69,83.06 153.77,83.97 153.31,83.97 152.55,84.73 152.55,94.34 133.35,113.54 115.06,113.54 LCD.4
LCD_RST  (via drill 0.61)
  Top 0.152: v135.03,90.98 135.03,96.16 v122.07,109.12
  Bottom 0.152: v135.03,90.98 151.03,74.98 SV1.11 | v122.07,109.12 115.06,116.13 LCD.3
LCD_SD_CS
  Bottom 0.152: IC4.8 139.29,64.77 139.9,65.38 150.27,65.38 151.18,66.29 154.08,66.29 156.51,68.73 156.51,113.54 152.71,117.35 130.15,117.35 129.54,116.74 116.13,116.74 115.37,117.5 114.45,117.5 113.69,116.74 113.69,112.47 114.91,111.25 LCD.5
LITE
  Bottom 0.152: LCD.10 123.9,89.46 127.25,89.46 146.76,69.95 151.03,69.95 SV1.7
M_EN  (via drill 0.61)
  Top 0.152: v100.58,118.11 99.97,118.11 98.6,116.74 97.84,116.74 v97.08,117.5 | v160.63,80.47 154.08,73.91 153.77,73.91 152.55,72.69 152.55,72.08 153.62,71.02 153.62,69.95 SV1.8
  Bottom 0.152: 100.74,117.96 100.74,116.89 R5.1 | v97.08,117.5 96.62,117.04 96.62,115.67 96.93,115.37 97.54,115.37 MUX.15 | v160.63,80.47 160.63,110.34 144.93,126.03 116.43,126.03 115.98,126.49 109.27,126.49 100.74,117.96 | 100.74,117.96 v100.58,118.11
M_SIG  (via drill 0.61)
  Top 0.152: v87.63,110.19 87.63,112.62 v87.02,113.23 | v88.09,114.76 93.88,114.76 99.82,108.81 113.39,108.81 114.45,109.88 136.55,109.88 152.25,94.18 152.25,83.67 SV1.17
  Bottom 0.152: v87.63,110.19 88.54,109.27 89.15,109.27 89.31,109.42 90.22,109.42 MUX.1 | v87.02,113.23 87.02,113.69 v88.09,114.76
MISO
  Top 0.152: SV1.4 152.55,64.77 151.03,66.29 140.36,66.29 130.76,75.89 130.76,90.68 132.89,92.81 132.89,93.42 125.42,100.89 115.06,100.89 LCD.9
MOSI  (via drill 0.61)
  Top 0.152: v133.2,91.44 133.2,95.25 122.53,105.92 115.06,105.92 LCD.7
  Bottom 0.152: v133.2,91.44 150.72,73.91 151.03,73.91 152.25,72.69 152.25,69.8 153.62,68.43 153.62,67.36 SV1.6
MS0  (via drill 0.61)
  Top 0.152: v82.75,92.81 87.48,92.81 87.78,92.51 v101.04,92.51 | v103.33,93.73 113.23,93.73 114.61,92.35 v130.76,92.35
  Bottom 0.152: v82.75,92.81 82.75,110.49 87.78,115.52 88.39,115.52 88.54,115.37 90.22,115.37 MUX.10 | v101.04,92.51 102.11,92.51 v103.33,93.73 | v130.76,92.35 130.76,92.81 131.83,93.88 150.42,93.88 154.69,89.61 154.69,83.52 153.77,82.6 SV1.18
MS1  (via drill 0.61)
  Top 0.152: v92.2,104.55 102.87,104.55 114.45,92.96 130.3,92.96 130.45,93.12 v132.13,93.12
  Bottom 0.152: v92.2,104.55 92.2,114.76 91.14,115.82 90.37,115.82 MUX.11 | v132.13,93.12 133.96,93.12 150.72,76.35 151.49,76.35 152.55,77.42 152.55,78.94 153.62,80.01 SV1.16
MS2  (via drill 0.61)
  Top 0.152: v104.39,104.55 105.31,104.55 112.62,97.23 125.27,97.23 v128.78,93.73 | v147.52,76.05 152.25,76.05 SV1.14
  Bottom 0.152: v104.39,104.55 104.39,109.88 98.45,115.82 97.69,115.82 MUX.14 | v128.78,93.73 128.78,93.27 146,76.05 v147.52,76.05
MS3  (via drill 0.61)
  Top 0.152: v98.3,117.5 98.91,117.5 107.9,126.49 123.6,126.49 v133.5,116.59
  Bottom 0.152: v98.3,117.5 98.3,117.35 97.69,116.74 MUX.13 | v133.5,116.59 153.01,116.59 156.21,113.39 156.21,77.42 153.77,74.98 SV1.12
N$1  (via drill 0.61)
  Top 0.152: v146.91,68.73 154.08,68.73 154.69,69.34 154.69,71.48 153.77,72.39 SV1.10 | v151.94,107.9 151.94,99.97 v154.99,96.93 | v83.97,70.26 89,70.26 v92.51,66.75 | v59.74,90.07 v59.74,115.37 | v82.75,87.48 82.75,86.87 84.89,84.73 v84.89,78.33
  Bottom 0.152: v146.91,68.73 144.32,66.14 140.82,66.14 IC4.20 140.66,65.99 135.33,65.99 134.72,65.38 114.45,65.38 112.78,67.06 95.4,67.06 95.1,66.75 IC3.20 94.94,66.75 v92.51,66.75 | v151.94,107.9 153.31,107.9 IC2.20 | v154.99,96.93 154.99,77.27 153.77,76.05 153.31,76.05 152.55,75.29 152.55,73.46 153.62,72.39 SV1.10 | 84.89,76.96 84.73,76.96 83.97,76.2 v83.97,70.26 | 84.89,76.96 85.04,76.96 R31.2 84.89,76.96 | v59.74,115.37 59.59,115.52 51.82,115.52 IC1.20 | v59.74,90.07 59.74,86.56 60.96,85.34 79.25,85.34 81.38,87.48 v82.75,87.48 | 84.89,76.96 v84.89,78.33
N$3
  Bottom 0.152: R12.1 27.28,17.37 27.28,20.27 S1_APPLY.-2
N$4
  Bottom 0.152: R11.1 174.8,48.16 174.5,48.16 173.74,47.4 171.6,47.4 170.84,48.16 D8.K
N$5
  Bottom 0.152: R13.1 24.84,17.37 24.84,20.27 S1_APPLY.-1
N$6
  Bottom 0.152: R14.1 44.5,17.37 44.5,19.81 44.96,20.27 S1BEAT1.-
N$7
  Bottom 0.152: R15.1 58.37,17.37 58.37,20.27 S1BEAT2.-
N$8
  Bottom 0.152: R16.1 71.17,17.37 71.17,19.81 71.63,20.27 S1BEAT3.-
N$9
  Bottom 0.152: R17.1 85.04,17.37 85.04,20.27 S1OFFBEAT.-
N$10
  Bottom 0.152: R10.1 154.38,48.31 153.62,49.07 150.11,49.07 149.35,48.31 D9.K
N$11
  Bottom 0.152: R9.1 132.89,48.16 132.59,48.16 131.83,47.4 128.47,47.4 127.71,48.16 D10.K
N$12
  Bottom 0.152: R8.1 111.25,48.31 110.49,49.07 106.83,49.07 106.07,48.31 D11.K
N$13
  Bottom 0.152: R18.1 104.85,16.76 104.85,20.27 S2_APPLY.-2
N$14
  Bottom 0.152: R7.1 85.5,48.31 83.21,48.31 D1.K
N$15
  Bottom 0.152: R4.1 42.22,48.31 40.08,48.31 D3.K
N$16
  Bottom 0.152: R2.1 20.73,48.31 18.44,48.31 D4.K
N$17
  Bottom 0.152: R6.1 63.86,48.31 61.72,48.31 D2.K
N$18
  Bottom 0.152: R21.1 149.2,17.37 149.2,20.27 S2BEAT3.-
N$19
  Bottom 0.152: R20.1 135.94,17.37 135.94,20.27 S2BEAT2.-
N$20
  Bottom 0.152: R23.1 15.85,121.92 18.29,124.36 D5.K
N$21
  Bottom 0.152: R3.1 102.26,16.76 102.26,20.27 S2_APPLY.-1
N$22
  Bottom 0.152: R19.1 121.92,19.66 122.53,20.27 S2BEAT1.-
N$24
  Bottom 0.152: R24.1 31.24,123.29 30.94,123.29 29.87,124.36 24.84,124.36 D6.K
N$25
  Bottom 0.152: R25.1 12.34,111.86 13.41,111.86 18.29,116.74 D7.K
N$26
  Bottom 0.152: R22.1 162.61,17.37 162.61,20.27 S2OFFBEAT.-
N$27
  Bottom 0.152: R30.1 16,74.52 18.44,74.52 18.75,74.83 RUN.5
N$28
  Bottom 0.152: R28.1 16,61.87 18.44,61.87 18.75,62.18 STEP.5
N$30
  Bottom 0.152: R26.1 15.85,106.68 18.29,109.12 D12.K
N$31
  Bottom 0.152: R1.2 32.31,74.52 29.87,74.52 29.57,74.83 STOP.6
N$33
  Bottom 0.152: R29.1 32.46,61.87 34.9,61.87 35.2,62.18 HOLD.5
N$34
  Bottom 0.152: R27.1 12.34,100.43 17.22,100.43 18.29,101.5 D13.K
POT1
  Bottom 0.152: MUX.9 90.37,114.61 90.98,114.61 91.59,114 91.59,108.51 83.82,100.74 83.82,86.87 66.6,69.65 33.22,69.65 25.45,61.87 25.45,39.32 24.23,38.1 S1_STEP1.P$2
POT2  (via drill 0.61)
  Top 0.152: v84.28,103.94 84.28,96.32 60.35,72.39 60.35,70.71 61.42,69.65 69.34,69.65 71.63,67.36 71.63,63.86 45.87,38.1 S1_STEP2.P$2
  Bottom 0.152: v84.28,103.94 85.8,105.46 85.8,110.95 88.85,114 90.22,114 MUX.8
POT3  (via drill 0.61)
  Top 0.152: v85.04,103.02 85.04,96.62 80.01,91.59 80.01,87.02 76.2,83.21 76.2,46.94 67.36,38.1 S1_STEP3.P$2
  Bottom 0.152: v85.04,103.02 85.04,104.09 86.11,105.16 86.11,110.8 88.54,113.23 90.22,113.23 MUX.7
POT4  (via drill 0.61)
  Top 0.152: v86.41,104.39 86.41,97.54 80.31,91.44 80.31,86.87 80.01,86.56 80.01,67.51 80.16,67.36 82.3,67.36 82.6,67.06 82.6,64.01 81.53,62.94 81.53,51.66 87.33,45.87 87.33,39.47 88.7,38.1 S1_STEP4.P$2
  Bottom 0.152: v86.41,104.39 86.41,110.64 88.54,112.78 90.22,112.78 MUX.6
POT5  (via drill 0.61)
  Top 0.152: v88.85,112.01 90.83,112.01 v96.16,106.68 | v105,72.24 113.54,72.24 114.45,71.32 114.45,69.34 112.17,67.06 111.86,67.06 v110.49,65.68
  Bottom 0.152: v88.85,112.01 90.22,112.01 MUX.5 | v96.16,106.68 96.16,96.62 96.62,96.16 96.62,92.35 93.27,89 93.27,86.41 102.87,76.81 102.87,74.37 v105,72.24 | v110.49,65.68 110.49,57 102.26,48.77 102.26,47.55 111.71,38.1 S2_STEP1.P$2
POT6  (via drill 0.61)
  Top 0.152: v85.04,106.38 v87.17,108.51 | v83.06,90.68 92.05,90.68 v94.03,88.7 | v119.79,70.41 119.79,51.66 130.3,41.15 v130.3,41
  Bottom 0.152: v87.17,108.51 86.87,108.81 86.87,110.49 87.33,110.95 88.85,110.95 89.31,111.4 90.22,111.4 MUX.4 | v85.04,106.38 85.04,105.77 83.52,104.24 83.52,91.14 v83.06,90.68 | v94.03,88.7 111.25,71.48 111.25,70.71 111.86,70.1 119.48,70.1 v119.79,70.41 | v130.3,41 133.2,38.1 S2_STEP2.P$2
POT7  (via drill 0.61)
  Top 0.152: v90.53,108.51 93.27,108.51 95.86,105.92 96.93,105.92 v97.38,106.38 | v111.56,75.44 124.82,75.44 134.72,65.53 v134.72,56.08 | v138.68,39.78 153.16,39.78 154.84,38.1 S2_STEP3.P$2
  Bottom 0.152: v90.53,108.51 90.68,108.51 91.29,109.12 91.29,110.34 90.98,110.64 90.37,110.64 MUX.3 | v97.38,106.38 97.38,89.61 v111.56,75.44 | v134.72,56.08 134.72,55.47 138.68,51.51 v138.68,39.78
POT8  (via drill 0.61)
  Top 0.152: v88.85,110.03 88.85,108.05 v90.53,106.38 | v92.35,103.33 92.66,103.33 103.17,92.81 113.69,92.81 115.52,90.98 124.51,90.98 130.45,85.04 130.45,75.74 141.88,64.31 145.24,64.31 171.45,38.1 S2_STEP4.P$2
  Bottom 0.152: v88.85,110.03 90.22,110.03 MUX.2 | v90.53,106.38 90.53,105.16 v92.35,103.33
POT9
  Bottom 0.152: MUX.23 97.54,110.03 96.77,110.03 94.03,107.29 94.03,97.69 88.7,92.35 88.7,83.21 82.6,77.11 82.6,69.8 81.38,68.58 TEMPO.P$2
POT10  (via drill 0.61)
  Top 0.152: v102.41,110.8 107.75,110.8 114.45,117.5 v116.43,117.5
  Bottom 0.152: v102.41,110.8 97.69,110.8 MUX.22 | v116.43,117.5 129.84,117.5 130,117.65 152.86,117.65 159.87,110.64 159.87,80.16 167.79,72.24 169.77,72.24 175.87,66.14 VOLUME.P$2
POT11  (via drill 0.61)
  Top 0.152: v105,127.56 v96.77,119.33
  Bottom 0.152: v96.77,119.33 96.32,118.87 96.32,112.17 96.93,111.56 97.54,111.56 MUX.21 | v105,127.56 143.87,127.56 174.65,96.77 174.65,85.04 175.87,83.82 DRUMVOL.P$2
RUN1  (via drill 0.61)
  Top 0.152: v124.21,90.22 102.87,90.22 102.56,89.92 97.54,89.92 85.04,77.42 v81.23,77.42 | v70.87,67.06 38.71,67.06 34.9,63.25 14.02,63.25 13.11,62.33 STEP.6
  Bottom 0.152: v124.21,90.22 131.67,97.69 143.71,97.69 IC2.1 | v70.87,67.06 v81.23,77.42
RUN2  (via drill 0.61)
  Top 0.152: v128.32,99.06 127.71,99.06 121.92,104.85 107.14,104.85 106.38,105.61 79.7,105.61 61.57,87.48 51.51,87.48 29.87,65.84 19.51,65.84 18.44,64.77 STEP.2 18.29,64.77 16.76,66.29 15.24,66.29 13.72,64.77 STEP.1
  Bottom 0.152: v128.32,99.06 IC2.2
RUN3  (via drill 0.61)
  Top 0.152: v103.94,91.75 102.41,90.22 96.62,90.22 92.51,86.11 v84.58,86.11
  Bottom 0.152: v103.94,91.75 114.45,102.26 115.37,102.26 117.5,100.13 129.39,100.13 129.54,100.28 143.71,100.28 IC2.3 | v84.58,86.11 83.97,86.11 64.92,67.06 49.53,67.06 45.72,63.25 30.48,63.25 29.57,62.33 HOLD.6
RUN4  (via drill 0.61)
  Top 0.152: v106.22,104.7 105.61,104.7 105,105.31 81.38,105.31 62.48,86.41 62.48,85.95 53.65,77.11 47.4,77.11 35.05,64.77 HOLD.2 34.9,64.77 33.38,66.29 31.7,66.29 30.18,64.77 HOLD.1
  Bottom 0.152: v106.22,104.7 115.52,104.7 118.57,101.65 143.71,101.65 IC2.4
RUN5  (via drill 0.61)
  Top 0.152: v115.98,107.29 96.62,107.29 89.92,114 85.5,114 61.42,89.92 60.66,89.92 60.05,89.31 43.43,89.31 42.82,89.92 v40.23,89.92 | 35.2,75.89 35.2,77.27 35.05,77.42 STOP.2 | 35.2,75.89 35.2,74.98 STOP.5 | 35.2,75.89 31.85,75.89 30.33,77.42 29.87,77.42 STOP.1
  Bottom 0.152: IC2.5 120.4,102.87 v115.98,107.29 | v40.23,89.92 40.23,82.75 35.05,77.57 STOP.2
RUN6  (via drill 0.61)
  Top 0.152: v101.04,115.21 94.34,115.21 93.27,116.28 59.59,116.28 33.22,89.92 24.23,89.92 19.05,84.73 19.05,79.1 | 19.05,79.1 19.05,78.18 18.44,77.57 RUN.2 | 19.05,79.1 15.39,79.1 13.87,77.57 13.41,77.57 RUN.1
  Bottom 0.152: v101.04,115.21 106.38,109.88 115.37,109.88 121.01,104.24 143.71,104.24 IC2.6
RUN7  (via drill 0.61)
  Top 0.152: v145.09,107.29 145.09,107.59 124.05,128.63 53.34,128.63 34.44,109.73 22.25,109.73 9.14,96.62 9.14,78.79 12.95,74.98 RUN.6
  Bottom 0.152: v145.09,107.29 145.09,106.53 144.63,106.07 144.47,106.07 143.87,105.46 IC2.7
S1LED1
  Bottom 0.152: IC3.22 94.94,64.01 94.64,64.01 88.09,57.45 88.09,46.18 66.9,24.99 59.44,24.99 56.69,22.25 49.07,22.25 48.16,21.34 46.02,21.34 45.41,21.95 44.2,21.95 42.67,20.42 S1BEAT1.+
S1LED2
  Bottom 0.152: IC3.24 94.94,61.57 94.34,60.96 94.18,60.96 88.7,55.47 88.7,45.87 67.21,24.38 59.89,24.38 55.93,20.42 S1BEAT2.+
S1LED3  (via drill 0.61)
  Top 0.152: v86.87,36.12 75.13,24.38 73.3,24.38 69.34,20.42 S1BEAT3.+
  Bottom 0.152: v86.87,36.12 86.87,41.3 95.86,50.29 95.86,58.22 95.1,58.98 IC3.26
S1LED4  (via drill 0.61)
  Top 0.152: v94.94,50.44 94.94,48.92 87.63,41.6 87.63,39.62 87.94,39.32 89.92,39.32 90.22,39.01 90.22,28.04 82.6,20.42 S1OFFBEAT.+
  Bottom 0.152: v94.94,50.44 94.94,56.39 IC3.28
S1LED5
  Bottom 0.152: IC3.2 85.34,57.76 76.96,57.76 63.86,44.65 46.48,44.65 22.25,20.42 S1_APPLY.+1
S1LED6
  Bottom 0.152: IC3.3 85.5,58.98 85.95,58.52 86.11,58.52 86.26,58.37 86.26,57.3 86.11,57.15 76.81,57.15 64.01,44.35 46.79,44.35 31.39,28.96 31.39,21.95 29.87,20.42 S1_APPLY.+2
S1LED7  (via drill 0.61)
  Top 0.152: v31.24,39.32 23.16,39.32 16,46.48 16,48.16 D4.A
  Bottom 0.152: v31.24,39.32 36.88,44.96 63.7,44.96 78.94,60.2 85.34,60.2 IC3.4
S1LED8  (via drill 0.61)
  Top 0.152: v86.72,61.72 83.21,61.72 v82.3,62.64
  Bottom 0.152: v86.72,61.72 85.5,61.72 IC3.5 | v82.3,62.64 75.29,62.64 62.48,49.84 39.01,49.84 37.49,48.31 D3.A
S1LED9
  Bottom 0.152: IC3.6 85.5,62.94 85.95,63.4 86.11,63.4 86.26,63.55 86.26,64.62 86.11,64.77 84.58,64.77 83.06,63.25 83.06,62.33 81.23,60.5 73.61,60.5 62.64,49.53 60.35,49.53 59.13,48.31 D2.A
S1LED10
  Bottom 0.152: IC3.7 85.34,64.01 84.89,63.55 84.73,63.55 84.43,63.25 84.43,61.11 84.58,60.96 86.11,60.96 86.56,60.5 86.56,54.1 80.77,48.31 D1.A
S1SW1  (via drill 0.61)
  Top 0.152: v79.25,45.11 56.08,21.95 48.77,21.95 43.74,16.92 39.62,16.92 39.01,16.31 39.01,11.12 39.93,10.21 S1BEAT1.1
  Bottom 0.152: v79.25,45.11 81.84,47.7 81.84,48.62 86.87,53.65 86.87,57.45 94.18,64.77 94.34,64.77 94.94,65.38 IC3.21
S1SW2  (via drill 0.61)
  Top 0.152: v54.86,16 v54.86,17.68
  Bottom 0.152: v54.86,17.68 54.86,21.34 55.47,21.95 56.84,21.95 59.59,24.69 67.06,24.69 88.39,46.02 88.39,56.39 94.34,62.33 94.49,62.33 94.94,62.79 IC3.23 | v54.86,16 54.86,11.73 53.34,10.21 S1BEAT2.1
S1SW3  (via drill 0.61)
  Top 0.152: v83.67,11.73 68.28,11.73 66.75,10.21 S1BEAT3.1
  Bottom 0.152: v83.67,11.73 86.41,14.48 86.41,16 89.15,18.75 89.15,23.47 87.63,24.99 87.63,41.6 96.16,50.14 96.16,59.28 95.71,59.74 95.56,59.74 95.1,60.2 IC3.25
S1SW4
  Bottom 0.152: IC3.27 94.94,57.76 94.34,57.15 94.18,57.15 89,51.97 89,43.89 86.11,41 86.11,15.24 81.08,10.21 80.01,10.21 S1OFFBEAT.1
S1SW5  (via drill 0.61)
  Top 0.152: v41.3,24.69 26.82,10.21 22.25,10.21 S1_APPLY.1
  Bottom 0.152: v41.3,24.69 55.93,39.32 68.28,39.32 85.34,56.39 IC3.1
S2LED1  (via drill 0.61)
  Top 0.152: v139.29,63.4 139.29,59.59 131.37,51.66 131.37,31.7 120.09,20.42 S2BEAT1.+
  Bottom 0.152: v139.29,63.4 140.66,63.4 IC4.22
S2LED2  (via drill 0.61)
  Top 0.152: v142.04,60.81 142.04,51.51 132.13,41.6 132.13,21.64 133.35,20.42 S2BEAT2.+
  Bottom 0.152: IC4.24 141.88,60.96 v142.04,60.81
S2LED3
  Bottom 0.152: IC4.26 140.82,58.37 145.39,53.8 145.39,39.32 151.79,32.92 151.79,25.45 146.76,20.42 S2BEAT3.+
S2LED4  (via drill 0.61)
  Top 0.152: v151.03,29.41 160.02,20.42 S2OFFBEAT.+
  Bottom 0.152: v151.03,29.41 151.03,33.22 140.82,43.43 140.82,55.78 IC4.28
S2LED5
  Bottom 0.152: IC4.2 131.22,57.15 133.81,54.56 133.81,45.57 108.2,19.96 108.2,19.2 107.75,18.75 106.83,18.75 105.77,19.81 105.77,21.34 105.16,21.95 101.35,21.95 99.82,20.42 S2_APPLY.+1
S2LED6
  Bottom 0.152: IC4.3 131.06,58.37 130.45,58.37 126.34,54.25 126.34,44.96 108.81,27.43 108.81,21.79 107.44,20.42 S2_APPLY.+2
S2LED7
  Bottom 0.152: IC4.4 131.22,59.74 131.83,60.35 131.98,60.35 131.98,61.57 116.89,61.57 103.63,48.31 D11.A
S2LED8
  Bottom 0.152: IC4.5 131.06,60.96 130.45,60.35 130.3,60.35 125.12,55.17 125.12,48.31 D10.A
S2LED9
  Bottom 0.152: IC4.6 131.22,62.18 138.07,62.18 139.9,60.35 141.43,60.35 146.61,55.17 146.61,48.31 D9.A
S2LED10
  Bottom 0.152: IC4.7 131.22,63.4 138.07,63.4 139.9,61.57 149.81,61.57 163.07,48.31 168.25,48.31 D8.A
S2SW1  (via drill 0.61)
  Top 0.152: v142.04,63.55 142.04,61.87 131.67,51.51 131.67,24.38 117.5,10.21 S2BEAT1.1
  Bottom 0.152: v142.04,63.55 140.82,64.77 IC4.21
S2SW2
  Bottom 0.152: IC4.23 140.82,62.18 149.66,62.18 162.31,49.53 168.71,49.53 169.47,48.77 169.47,47.7 163.68,41.91 153.92,41.91 153.31,41.3 153.31,18.75 150.11,15.54 150.11,15.09 146.76,11.73 132.44,11.73 130.91,10.21 S2BEAT2.1
S2SW3  (via drill 0.61)
  Top 0.152: v146.46,16.46 146.46,12.5 144.17,10.21 S2BEAT3.1
  Bottom 0.152: v146.46,16.46 146.46,16.92 139.45,23.93 139.45,58.67 140.36,59.59 140.66,59.59 IC4.25
S2SW4  (via drill 0.61)
  Top 0.152: v147.98,16.76 148.28,16.76 154.84,10.21 157.43,10.21 S2OFFBEAT.1
  Bottom 0.152: v147.98,16.76 139.75,24.99 139.75,56.39 139.9,56.54 140.06,56.54 IC4.27
S2SW5  (via drill 0.61)
  Top 0.152: v131.06,53.19 131.06,40.69 125.88,35.51 125.58,35.51 108.2,18.14 108.2,14.17 104.24,10.21 99.82,10.21 S2_APPLY.1
  Bottom 0.152: v131.06,53.19 131.06,55.78 IC4.1
SCK  (via drill 0.61)
  Top 0.152: SV1.3 152.09,64.77 153.16,63.7 154.08,63.7 154.69,64.31 154.69,65.23 153.62,66.29 153.16,66.29 152.25,67.21 152.25,67.67 151.49,68.43 147.68,68.43 147.22,67.97 139.6,67.97 131.37,76.2 131.37,88.09 134.26,90.98 134.26,95.71 v129.08,100.89
  Bottom 0.152: v129.08,100.89 117.65,100.89 115.06,103.48 LCD.8
SCL  (via drill 0.61)
  Top 0.152: v139.29,71.93 141.88,71.93 149.96,80.01 SV1.15 | v90.07,70.26 97.23,70.26 97.38,70.1 101.8,70.1 104.7,73 126.19,73 v129.39,69.8 | v153.31,88.7 154.08,89.46 154.08,97.38 146.46,105 v146.46,109.42 126.95,128.93 53.19,128.93 44.2,119.94 v43.59,119.94
  Bottom 0.152: v139.29,71.93 137.31,69.95 131.22,69.95 IC4.12 131.06,69.8 v129.39,69.8 | v90.07,70.26 89.92,70.41 85.5,70.41 IC3.12 | v146.46,109.42 144.17,111.71 143.87,111.71 IC2.12 | v153.31,88.7 150.11,85.5 150.11,80.92 151.03,80.01 SV1.15 | v43.59,119.94 43.13,119.48 42.22,119.48 IC1.12
SDA  (via drill 0.61)
  Top 0.152: v137.47,71.17 141.58,71.17 147.83,77.42 151.03,77.42 SV1.13 | v153.31,89.92 153.31,94.03 147.22,100.13 v147.22,103.17 145.54,103.17 141.73,106.98 141.73,109.42 v124.36,126.8
  Bottom 0.152: v137.47,71.17 131.22,71.17 IC4.13 131.06,71.02 129.54,71.02 128.17,69.65 106.53,69.65 99.97,76.2 84.43,76.2 84.28,76.05 84.28,72.69 84.58,72.39 84.73,72.39 85.34,71.78 IC3.13 | v147.22,103.17 147.22,109.73 144.47,112.47 144.32,112.47 143.87,112.93 IC2.13 | v153.31,89.92 149.81,86.41 149.81,78.79 SV1.13 | v124.36,126.8 55.17,126.8 49.07,120.7 42.22,120.7 IC1.13
SEL1
  Bottom 0.152: IC1.4 42.06,109.27 35.36,109.27 18.9,125.73 17.22,125.73 16,124.51 D5.A
SEL2
  Bottom 0.152: IC1.8 32.31,114.3 22.25,124.36 D6.A
SEL3  (via drill 0.61)
  Top 0.152: v155.45,104.85 155.45,105.92 131.83,129.54 31.55,129.54 20.12,118.11 17.22,118.11 16,116.89 D7.A
  Bottom 0.152: v155.45,104.85 153.47,102.87 IC2.24
SEL4  (via drill 0.61)
  Top 0.152: v154.69,98.75 154.69,106.22 131.67,129.24 35.97,129.24 16,109.27 D12.A
  Bottom 0.152: v154.69,98.75 153.77,97.84 153.47,97.84 IC2.28
SEL5  (via drill 0.61)
  Top 0.152: v142.49,107.29 142.49,109.73 123.9,128.32 53.49,128.32 34.59,109.42 23.77,109.42 16,101.65 D13.A
  Bottom 0.152: IC2.8 143.1,106.68 v142.49,107.29
TFT_CS
  Top 0.152: SV1.5 151.03,67.36 139.75,67.36 131.06,76.05 131.06,88.24 133.96,91.14 133.96,94.94 120.4,108.51 115.06,108.51 LCD.6
VCC  (via drill 0.61)
  Top 0.152: v85.19,115.52 93.57,115.52 99.52,109.58 v100.13,109.58 109.27,118.72 114.91,118.72 LCD.2 115.06,118.72 116.28,118.72 v120.4,114.61 | S2_STEP2.P$1 133.5,35.66 154.84,35.66 S2_STEP3.P$1 154.99,35.66 176.48,35.66 S2_STEP4.P$1 176.63,35.66 176.63,35.97 177.85,37.19 177.85,61.57 176.02,63.4 VOLUME.P$1 | 156.21,85.04 172.21,85.04 175.87,81.38 DRUMVOL.P$1 | 156.21,85.04 153.77,85.04 SV1.20 | S1_STEP1.P$1 24.23,35.66 45.72,35.66 S1_STEP2.P$1 45.87,35.66 67.21,35.66 S1_STEP3.P$1 67.36,35.66 77.57,45.87 81.08,45.87 | 81.08,45.87 83.67,43.28 83.67,40.84 88.85,35.66 S1_STEP4.P$1 | 81.08,45.87 81.84,46.63 81.84,48.77 81.23,49.38 81.23,65.99 TEMPO.P$1 | v140.82,74.83 151.03,85.04 SV1.19 | v154.84,109.12 154.84,106.98 156.21,105.61 156.21,85.04
  Bottom 0.152: 135.18,113.69 135.18,113.08 140.21,108.05 143.71,108.05 IC2.9 | 135.18,113.69 136.4,114.91 152.71,114.91 153.31,114.3 IC2.15 153.47,114.3 154.38,113.39 154.38,111.4 153.47,110.49 | IC1.9 42.22,115.67 49.23,115.67 51.66,118.11 IC1.18 82.6,118.11 v85.19,115.52 | v100.13,109.58 97.69,109.58 MUX.24 | 135.18,113.69 121.31,113.69 v120.4,114.61 | SV1.19 151.18,85.19 153.62,85.19 SV1.20 | VOLUME.P$1 176.02,63.55 176.02,63.86 177.09,64.92 177.09,80.16 176.02,81.23 DRUMVOL.P$1 | TEMPO.P$1 81.38,66.14 81.84,66.6 85.34,66.6 IC3.9 85.5,66.75 91.44,66.75 93.88,69.19 94.94,69.19 IC3.18 95.1,69.34 95.56,69.8 95.71,69.8 95.86,69.95 | 95.1,71.78 95.86,72.54 95.86,73.46 94.03,75.29 85.19,75.29 R31.1 | 95.86,69.95 95.86,71.02 95.1,71.78 | 95.1,71.78 IC3.16 | 95.86,69.95 98.3,67.51 112.78,67.51 114.15,66.14 131.06,66.14 IC4.9 131.22,66.14 135.03,66.14 137.47,68.58 IC4.18 140.82,68.58 141.58,69.34 141.58,70.41 141.43,70.56 141.28,70.56 140.82,71.02 IC4.16 140.66,71.17 IC4.15 140.82,72.39 v140.82,74.83 | S1_STEP4.P$1 89,35.66 111.71,35.66 S2_STEP1.P$1 | R1.1 32.31,72.69 32.31,69.19 23.32,60.2 23.32,42.06 22.86,41.6 22.86,36.88 24.08,35.66 S1_STEP1.P$1 | v154.84,109.12 153.47,110.49 | 153.47,110.49 IC2.18
  Bottom 0.156: C1.2 94.86,106.68 MUX.24

### Text on the board
tNames: EUCLIDEAN CONTROL BOARD | SERENDIPITY SYNTHESIZERS 2020